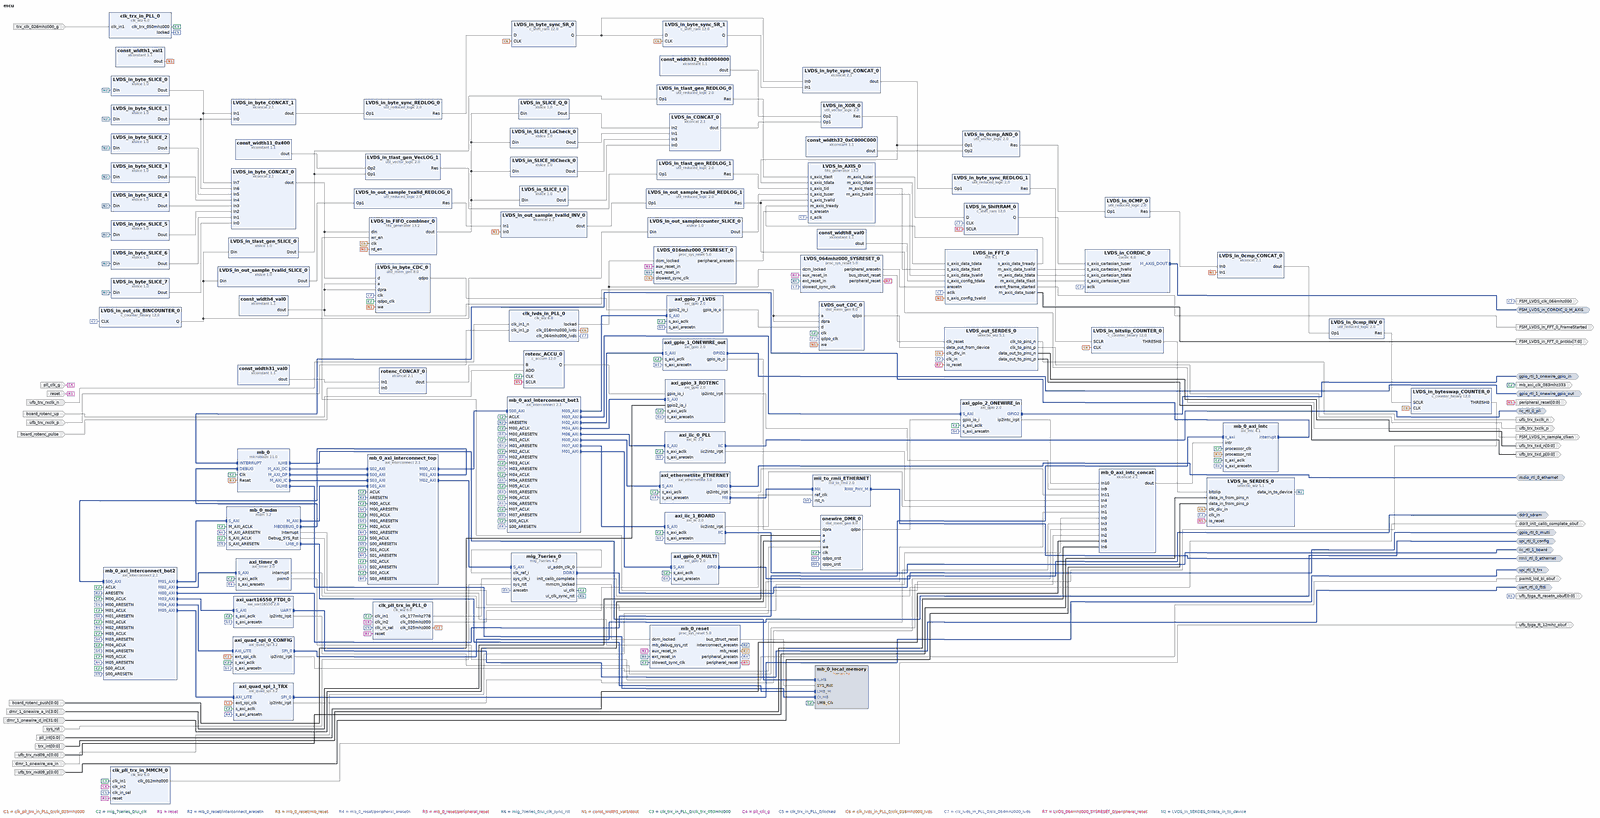
[diagram p0: block diagram of the top level, whole]
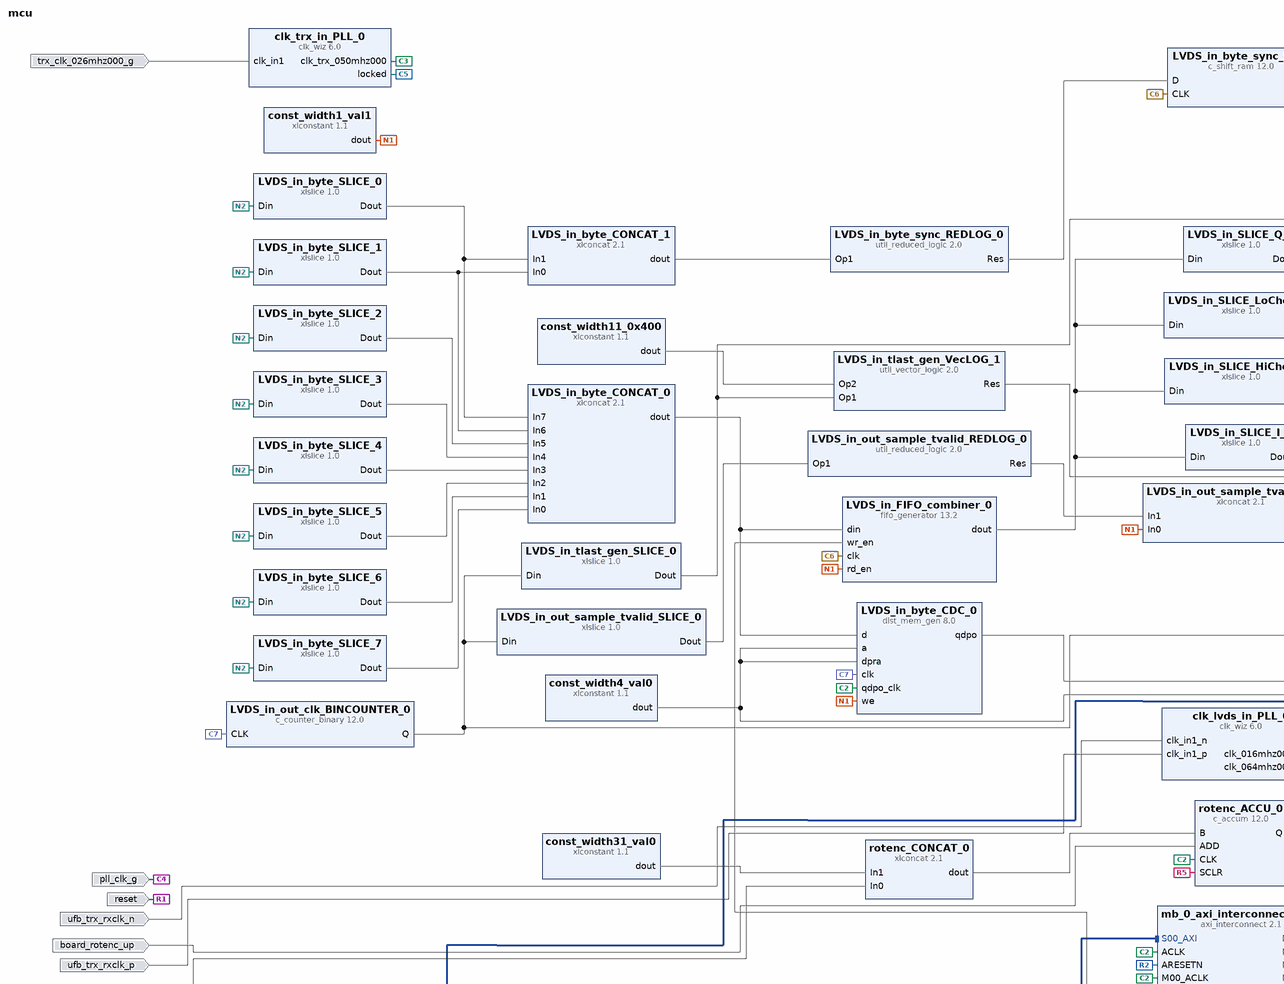
[diagram p1: block diagram of the top level, upper left part]
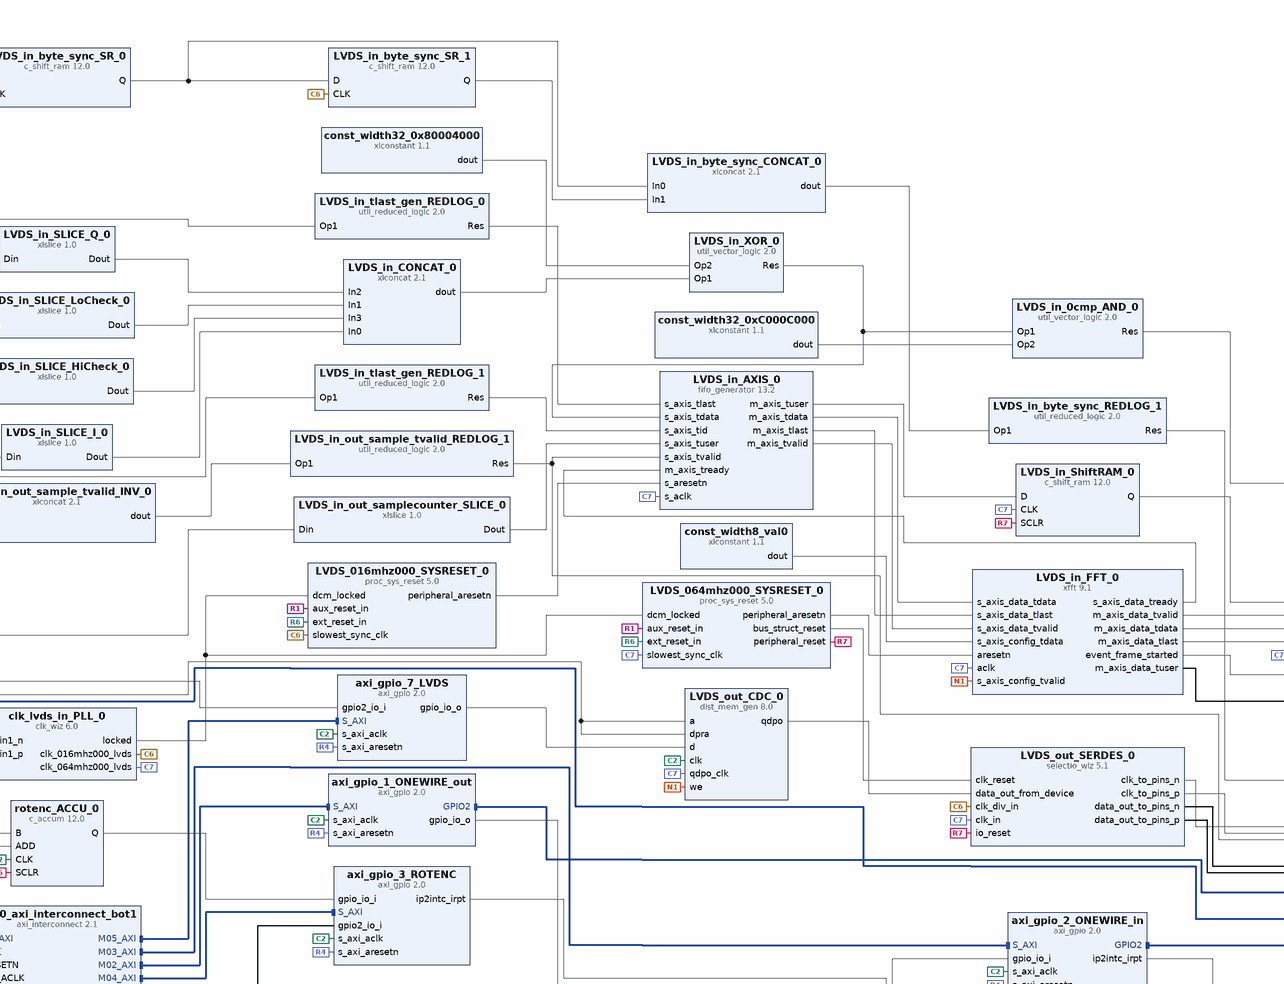
[diagram p2: block diagram of the top level, upper centre part]
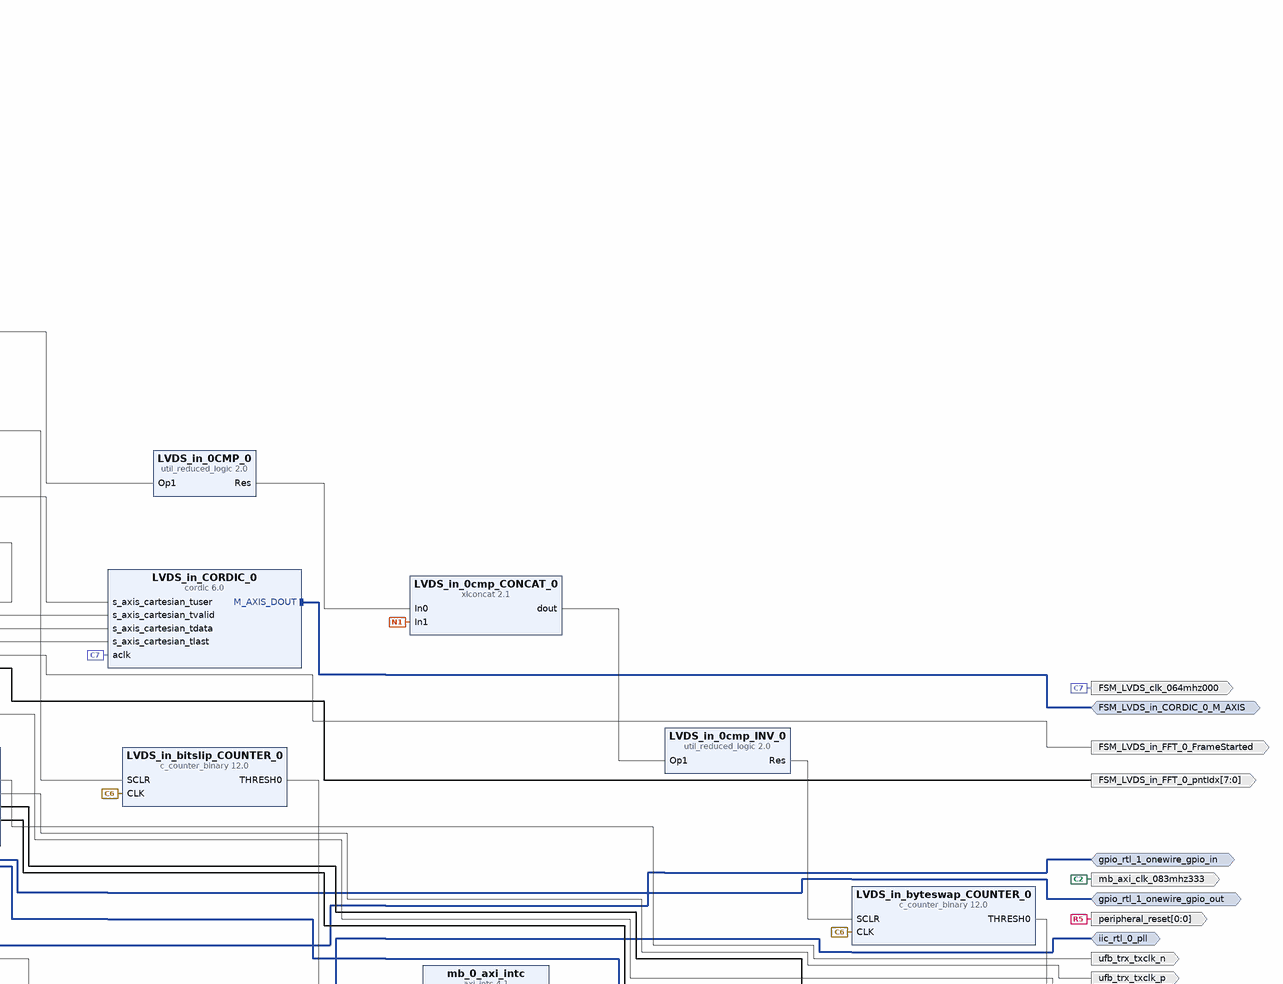
[diagram p3: block diagram of the top level, upper right part]
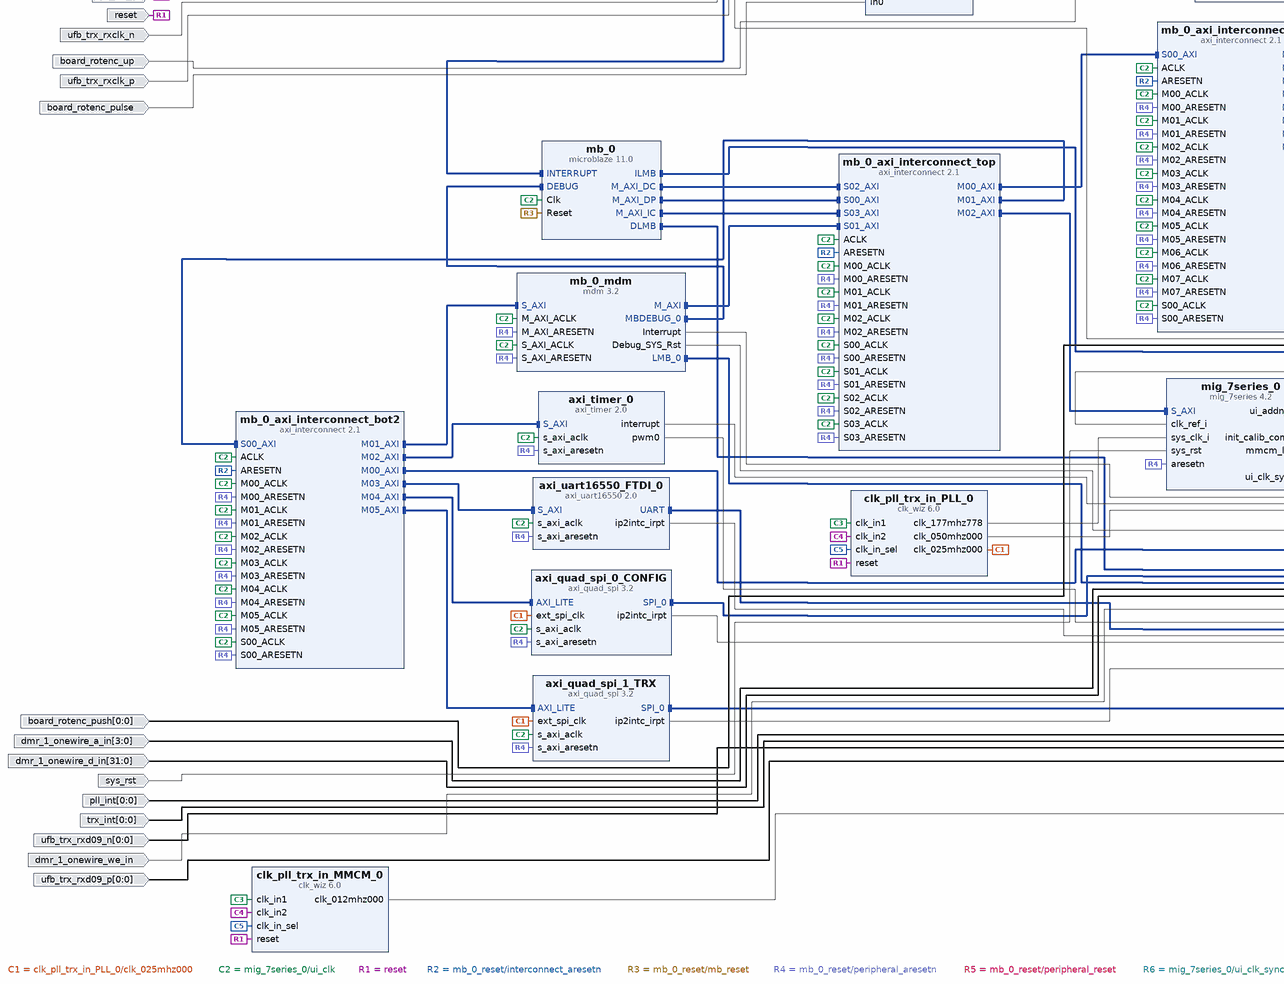
[diagram p4: block diagram of the top level, lower left part]
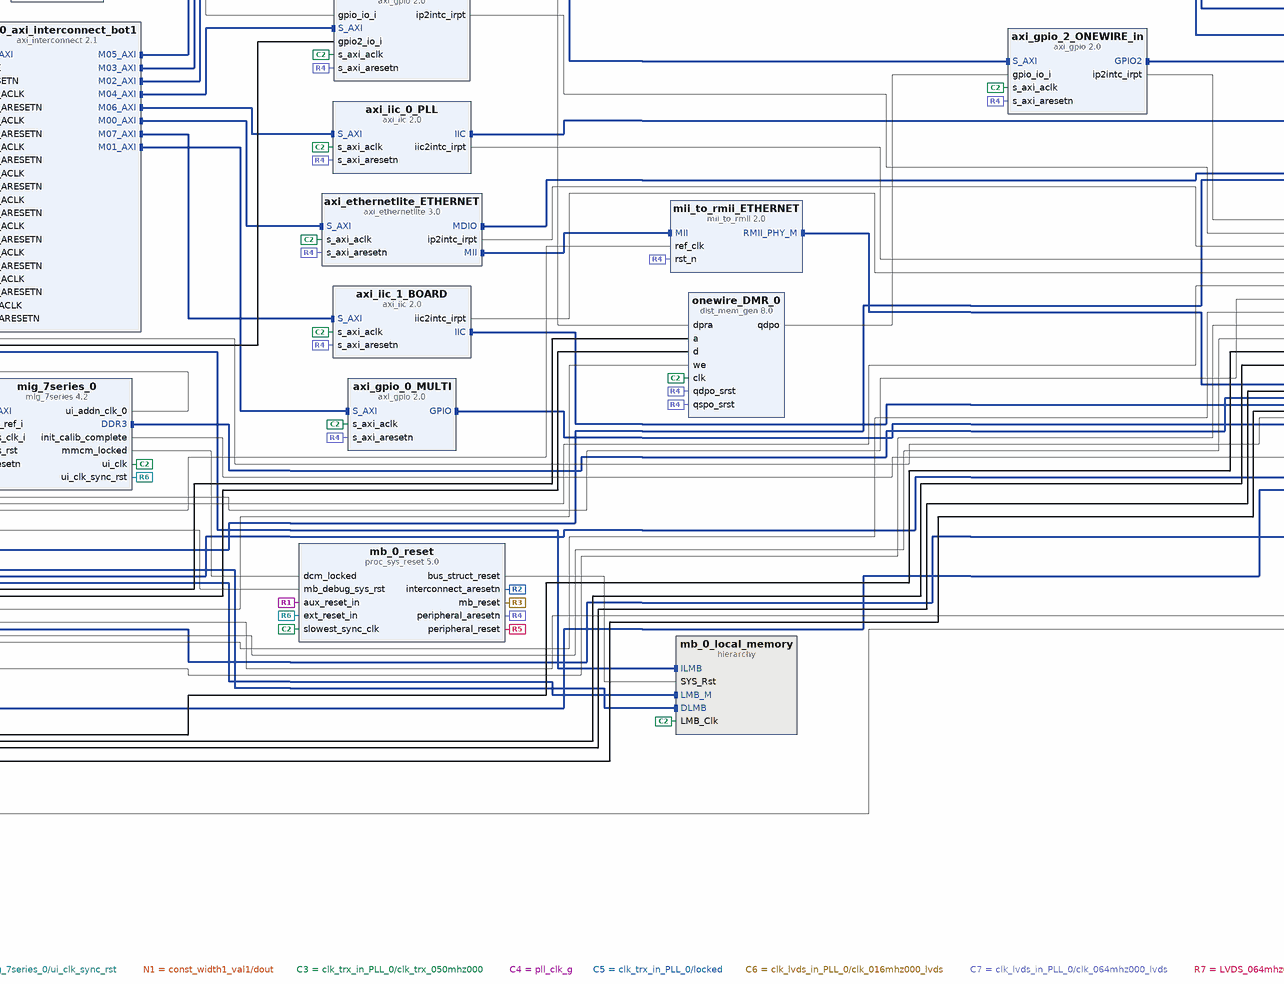
[diagram p5: block diagram of the top level, lower centre part]
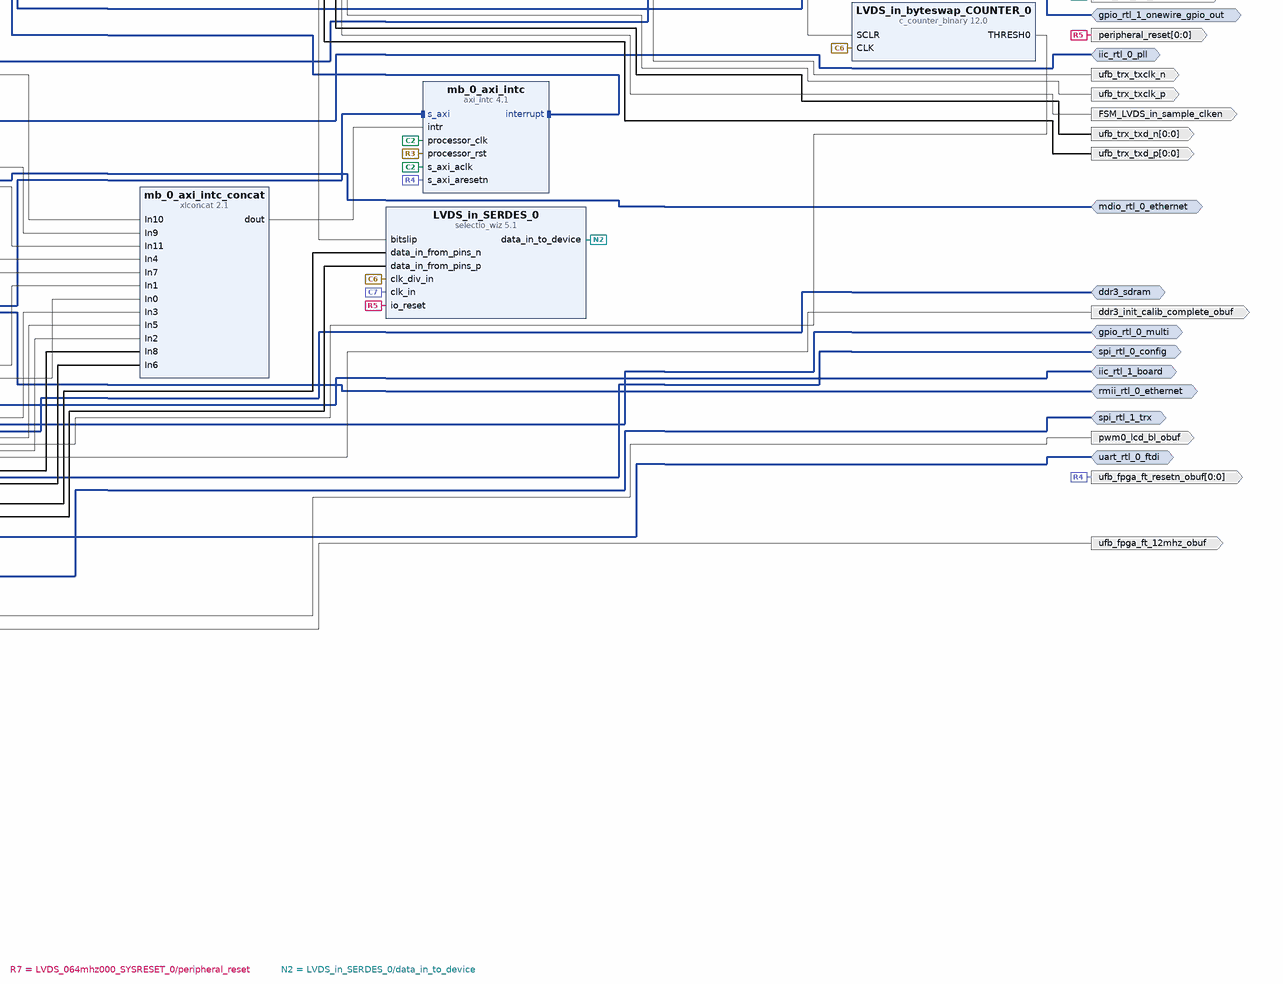
[diagram p6: block diagram of the top level, lower right part]
# Vivado block design mcu, xc7a100tfgg484-2, Vivado 2019.1.2
create_bd_design mcu

create_bd_intf_port -mode Master -vlnv xilinx.com:interface:ddrx_rtl:1.0 ddr3_sdram
create_bd_intf_port -mode Master -vlnv xilinx.com:interface:gpio_rtl:1.0 gpio_rtl_0_multi
create_bd_intf_port -mode Master -vlnv xilinx.com:interface:gpio_rtl:1.0 gpio_rtl_1_onewire_gpio_in
create_bd_intf_port -mode Master -vlnv xilinx.com:interface:gpio_rtl:1.0 gpio_rtl_1_onewire_gpio_out
create_bd_intf_port -mode Master -vlnv xilinx.com:interface:iic_rtl:1.0 iic_rtl_0_pll
create_bd_intf_port -mode Master -vlnv xilinx.com:interface:iic_rtl:1.0 iic_rtl_1_board
create_bd_intf_port -mode Master -vlnv xilinx.com:interface:mdio_rtl:1.0 mdio_rtl_0_ethernet
create_bd_intf_port -mode Master -vlnv xilinx.com:interface:rmii_rtl:1.0 rmii_rtl_0_ethernet
create_bd_intf_port -mode Master -vlnv xilinx.com:interface:spi_rtl:1.0 spi_rtl_0_config
create_bd_intf_port -mode Master -vlnv xilinx.com:interface:spi_rtl:1.0 spi_rtl_1_trx
create_bd_intf_port -mode Master -vlnv xilinx.com:interface:uart_rtl:1.0 uart_rtl_0_ftdi
create_bd_intf_port -mode Master -vlnv xilinx.com:interface:axis_rtl:1.0 FSM_LVDS_in_CORDIC_0_M_AXIS
set_property -dict {CONFIG.FREQ_HZ 64000000 CONFIG.PHASE 0.0} [get_bd_intf_ports FSM_LVDS_in_CORDIC_0_M_AXIS]
create_bd_port -dir I -type ce board_rotenc_pulse
create_bd_port -dir I -from 0 -to 0 board_rotenc_push
create_bd_port -dir I -type data board_rotenc_up
create_bd_port -dir O ddr3_init_calib_complete_obuf
create_bd_port -dir I -from 3 -to 0 dmr_1_onewire_a_in
create_bd_port -dir I -from 31 -to 0 dmr_1_onewire_d_in
create_bd_port -dir I dmr_1_onewire_we_in
create_bd_port -dir O -type clk mb_axi_clk_083mhz333
set_property -dict [list \
  CONFIG.ASSOCIATED_BUSIF gpio_rtl_1_onewire_gpio_in \
  CONFIG.ASSOCIATED_RESET peripheral_reset \
] [get_bd_ports mb_axi_clk_083mhz333]
create_bd_port -dir O -from 0 -to 0 -type rst peripheral_reset
create_bd_port -dir I -from 0 -to 0 pll_int
create_bd_port -dir O pwm0_lcd_bl_obuf
create_bd_port -dir I -type rst reset
set_property -dict {CONFIG.POLARITY ACTIVE_HIGH} [get_bd_ports reset]
create_bd_port -dir I -type rst sys_rst
set_property -dict {CONFIG.POLARITY ACTIVE_HIGH} [get_bd_ports sys_rst]
create_bd_port -dir I -from 0 -to 0 trx_int
create_bd_port -dir O -type clk ufb_fpga_ft_12mhz_obuf
set_property -dict {CONFIG.FREQ_HZ 12000000} [get_bd_ports ufb_fpga_ft_12mhz_obuf]
create_bd_port -dir O -from 0 -to 0 ufb_fpga_ft_resetn_obuf
create_bd_port -dir I -type clk ufb_trx_rxclk_n
set_property -dict {CONFIG.FREQ_HZ 32000000} [get_bd_ports ufb_trx_rxclk_n]
create_bd_port -dir I -type clk ufb_trx_rxclk_p
set_property -dict {CONFIG.FREQ_HZ 32000000} [get_bd_ports ufb_trx_rxclk_p]
create_bd_port -dir I -from 0 -to 0 ufb_trx_rxd09_n
create_bd_port -dir I -from 0 -to 0 ufb_trx_rxd09_p
create_bd_port -dir O -type clk ufb_trx_txclk_n
set_property -dict {CONFIG.FREQ_HZ 32000000} [get_bd_ports ufb_trx_txclk_n]
create_bd_port -dir O -type clk ufb_trx_txclk_p
set_property -dict {CONFIG.FREQ_HZ 32000000} [get_bd_ports ufb_trx_txclk_p]
create_bd_port -dir O -from 0 -to 0 ufb_trx_txd_n
create_bd_port -dir O -from 0 -to 0 ufb_trx_txd_p
create_bd_port -dir I -type clk pll_clk_g
set_property -dict {CONFIG.FREQ_HZ 50000000} [get_bd_ports pll_clk_g]
create_bd_port -dir I -type clk trx_clk_026mhz000_g
set_property -dict {CONFIG.FREQ_HZ 26000000} [get_bd_ports trx_clk_026mhz000_g]
create_bd_port -dir O -type clk FSM_LVDS_clk_064mhz000
create_bd_port -dir O -type intr FSM_LVDS_in_FFT_0_FrameStarted
create_bd_port -dir O -type ce FSM_LVDS_in_sample_clken
create_bd_port -dir O -from 7 -to 0 FSM_LVDS_in_FFT_0_pntIdx

create_bd_cell -type ip -vlnv xilinx.com:ip:dist_mem_gen:8.0 LVDS_in_byte_CDC_0
set_property -dict [list \
  CONFIG.Pipeline_Stages 1 \
  CONFIG.data_width 8 \
  CONFIG.depth 16 \
  CONFIG.dual_port_address non_registered \
  CONFIG.input_clock_enable false \
  CONFIG.input_options registered \
  CONFIG.memory_type simple_dual_port_ram \
  CONFIG.output_options registered \
  CONFIG.simple_dual_port_output_clock_enable false \
] [get_bd_cells LVDS_in_byte_CDC_0]
create_bd_cell -type ip -vlnv xilinx.com:ip:dist_mem_gen:8.0 LVDS_out_CDC_0
set_property -dict [list \
  CONFIG.Pipeline_Stages 1 \
  CONFIG.data_width 8 \
  CONFIG.depth 16 \
  CONFIG.dual_port_address non_registered \
  CONFIG.input_clock_enable false \
  CONFIG.input_options registered \
  CONFIG.memory_type simple_dual_port_ram \
  CONFIG.output_options registered \
  CONFIG.simple_dual_port_output_clock_enable false \
] [get_bd_cells LVDS_out_CDC_0]
create_bd_cell -type ip -vlnv xilinx.com:ip:axi_ethernetlite:3.0 axi_ethernetlite_ETHERNET
set_property -dict [list \
  CONFIG.C_DUPLEX 1 \
  CONFIG.C_INCLUDE_GLOBAL_BUFFERS 1 \
  CONFIG.C_INCLUDE_INTERNAL_LOOPBACK 1 \
  CONFIG.C_S_AXI_PROTOCOL AXI4LITE \
] [get_bd_cells axi_ethernetlite_ETHERNET]
create_bd_cell -type ip -vlnv xilinx.com:ip:axi_gpio:2.0 axi_gpio_0_MULTI
set_property -dict {CONFIG.C_ALL_OUTPUTS 1 CONFIG.C_GPIO_WIDTH 8} [get_bd_cells axi_gpio_0_MULTI]
create_bd_cell -type ip -vlnv xilinx.com:ip:axi_gpio:2.0 axi_gpio_1_ONEWIRE_out
set_property -dict [list \
  CONFIG.C_ALL_OUTPUTS 1 \
  CONFIG.C_ALL_OUTPUTS_2 1 \
  CONFIG.C_GPIO_WIDTH 4 \
  CONFIG.C_IS_DUAL 1 \
] [get_bd_cells axi_gpio_1_ONEWIRE_out]
create_bd_cell -type ip -vlnv xilinx.com:ip:axi_gpio:2.0 axi_gpio_2_ONEWIRE_in
set_property -dict [list \
  CONFIG.C_ALL_INPUTS 1 \
  CONFIG.C_ALL_INPUTS_2 1 \
  CONFIG.C_GPIO2_WIDTH 32 \
  CONFIG.C_GPIO_WIDTH 32 \
  CONFIG.C_INTERRUPT_PRESENT 1 \
  CONFIG.C_IS_DUAL 1 \
] [get_bd_cells axi_gpio_2_ONEWIRE_in]
create_bd_cell -type ip -vlnv xilinx.com:ip:axi_gpio:2.0 axi_gpio_3_ROTENC
set_property -dict [list \
  CONFIG.C_ALL_INPUTS 1 \
  CONFIG.C_ALL_INPUTS_2 1 \
  CONFIG.C_GPIO2_WIDTH 1 \
  CONFIG.C_INTERRUPT_PRESENT 1 \
  CONFIG.C_IS_DUAL 1 \
] [get_bd_cells axi_gpio_3_ROTENC]
create_bd_cell -type ip -vlnv xilinx.com:ip:axi_gpio:2.0 axi_gpio_7_LVDS
set_property -dict [list \
  CONFIG.C_ALL_INPUTS_2 1 \
  CONFIG.C_ALL_OUTPUTS 1 \
  CONFIG.C_GPIO2_WIDTH 8 \
  CONFIG.C_GPIO_WIDTH 8 \
  CONFIG.C_IS_DUAL 1 \
] [get_bd_cells axi_gpio_7_LVDS]
create_bd_cell -type ip -vlnv xilinx.com:ip:axi_iic:2.0 axi_iic_0_PLL
set_property -dict {CONFIG.C_SDA_LEVEL 1 CONFIG.IIC_FREQ_KHZ 400} [get_bd_cells axi_iic_0_PLL]
create_bd_cell -type ip -vlnv xilinx.com:ip:axi_iic:2.0 axi_iic_1_BOARD
set_property -dict {CONFIG.IIC_FREQ_KHZ 400} [get_bd_cells axi_iic_1_BOARD]
create_bd_cell -type ip -vlnv xilinx.com:ip:axi_quad_spi:3.2 axi_quad_spi_0_CONFIG
set_property -dict [list \
  CONFIG.C_FIFO_DEPTH 256 \
  CONFIG.C_SHARED_STARTUP 0 \
  CONFIG.C_SPI_MEMORY 3 \
  CONFIG.C_SPI_MODE 2 \
  CONFIG.C_TYPE_OF_AXI4_INTERFACE 0 \
  CONFIG.C_USE_STARTUP 1 \
] [get_bd_cells axi_quad_spi_0_CONFIG]
create_bd_cell -type ip -vlnv xilinx.com:ip:axi_quad_spi:3.2 axi_quad_spi_1_TRX
set_property -dict {CONFIG.C_SCK_RATIO 8 CONFIG.C_SPI_MODE 0 CONFIG.C_USE_STARTUP 0} [get_bd_cells axi_quad_spi_1_TRX]
create_bd_cell -type ip -vlnv xilinx.com:ip:axi_timer:2.0 axi_timer_0
create_bd_cell -type ip -vlnv xilinx.com:ip:axi_uart16550:2.0 axi_uart16550_FTDI_0
create_bd_cell -type ip -vlnv xilinx.com:ip:c_accum:12.0 rotenc_ACCU_0
set_property -dict [list \
  CONFIG.Accum_Mode Add_Subtract \
  CONFIG.Bypass false \
  CONFIG.CE false \
  CONFIG.C_In false \
  CONFIG.Implementation DSP48 \
  CONFIG.Input_Type Signed \
  CONFIG.Input_Width 32 \
  CONFIG.Latency_Configuration Automatic \
  CONFIG.Output_Width 32 \
  CONFIG.SCLR true \
] [get_bd_cells rotenc_ACCU_0]
create_bd_cell -type ip -vlnv xilinx.com:ip:clk_wiz:6.0 clk_lvds_in_PLL_0
set_property -dict [list \
  CONFIG.AXI_DRP false \
  CONFIG.CLKIN1_JITTER_PS 156.25 \
  CONFIG.CLKOUT1_DRIVES BUFG \
  CONFIG.CLKOUT1_JITTER 149.670 \
  CONFIG.CLKOUT1_MATCHED_ROUTING true \
  CONFIG.CLKOUT1_PHASE_ERROR 114.696 \
  CONFIG.CLKOUT1_REQUESTED_OUT_FREQ 128 \
  CONFIG.CLKOUT1_USED true \
  CONFIG.CLKOUT2_DRIVES BUFG \
  CONFIG.CLKOUT2_JITTER 174.718 \
  CONFIG.CLKOUT2_MATCHED_ROUTING false \
  CONFIG.CLKOUT2_PHASE_ERROR 114.696 \
  CONFIG.CLKOUT2_REQUESTED_OUT_FREQ 64 \
  CONFIG.CLKOUT2_USED true \
  CONFIG.CLKOUT3_DRIVES BUFG \
  CONFIG.CLKOUT3_JITTER 237.501 \
  CONFIG.CLKOUT3_PHASE_ERROR 114.696 \
  CONFIG.CLKOUT3_REQUESTED_OUT_FREQ 16 \
  CONFIG.CLKOUT3_USED true \
  CONFIG.CLKOUT4_DRIVES BUFG \
  CONFIG.CLKOUT4_JITTER 158.007 \
  CONFIG.CLKOUT4_PHASE_ERROR 114.696 \
  CONFIG.CLKOUT4_REQUESTED_OUT_FREQ 100.000 \
  CONFIG.CLKOUT4_USED false \
  CONFIG.CLKOUT5_DRIVES BUFG \
  CONFIG.CLKOUT6_DRIVES BUFG \
  CONFIG.CLKOUT7_DRIVES BUFG \
  CONFIG.CLK_OUT1_PORT clk_128mhz000_lvds \
  CONFIG.CLK_OUT1_USE_FINE_PS_GUI false \
  CONFIG.CLK_OUT2_PORT clk_064mhz000_lvds \
  CONFIG.CLK_OUT2_USE_FINE_PS_GUI false \
  CONFIG.CLK_OUT3_PORT clk_016mhz000_lvds \
  CONFIG.CLK_OUT4_PORT clk_out4 \
  CONFIG.FEEDBACK_SOURCE FDBK_AUTO \
  CONFIG.INTERFACE_SELECTION Enable_AXI \
  CONFIG.MMCM_BANDWIDTH OPTIMIZED \
  CONFIG.MMCM_CLKFBOUT_MULT_F 14 \
  CONFIG.MMCM_CLKIN1_PERIOD 15.625 \
  CONFIG.MMCM_CLKIN2_PERIOD 10.000 \
  CONFIG.MMCM_CLKOUT0_DIVIDE_F 7 \
  CONFIG.MMCM_CLKOUT0_USE_FINE_PS false \
  CONFIG.MMCM_CLKOUT1_DIVIDE 14 \
  CONFIG.MMCM_CLKOUT1_USE_FINE_PS false \
  CONFIG.MMCM_CLKOUT2_DIVIDE 56 \
  CONFIG.MMCM_CLKOUT3_DIVIDE 1 \
  CONFIG.MMCM_COMPENSATION ZHOLD \
  CONFIG.MMCM_DIVCLK_DIVIDE 1 \
  CONFIG.NUM_OUT_CLKS 3 \
  CONFIG.PHASE_DUTY_CONFIG false \
  CONFIG.PRIMITIVE PLL \
  CONFIG.PRIM_IN_FREQ 64 \
  CONFIG.PRIM_SOURCE Differential_clock_capable_pin \
  CONFIG.USE_DYN_PHASE_SHIFT false \
  CONFIG.USE_DYN_RECONFIG false \
  CONFIG.USE_LOCKED true \
  CONFIG.USE_RESET false \
  CONFIG.USE_SAFE_CLOCK_STARTUP false \
] [get_bd_cells clk_lvds_in_PLL_0]
create_bd_cell -type ip -vlnv xilinx.com:ip:dist_mem_gen:8.0 onewire_DMR_0
set_property -dict [list \
  CONFIG.Pipeline_Stages 0 \
  CONFIG.common_output_clk true \
  CONFIG.data_width 32 \
  CONFIG.depth 16 \
  CONFIG.dual_port_address registered \
  CONFIG.input_clock_enable false \
  CONFIG.input_options registered \
  CONFIG.memory_type dual_port_ram \
  CONFIG.output_options registered \
  CONFIG.simple_dual_port_output_clock_enable false \
  CONFIG.sync_reset_qdpo true \
  CONFIG.sync_reset_qspo true \
] [get_bd_cells onewire_DMR_0]
create_bd_cell -type ip -vlnv xilinx.com:ip:microblaze:11.0 mb_0
set_property -dict [list \
  CONFIG.C_ADDR_TAG_BITS 17 \
  CONFIG.C_AREA_OPTIMIZED 0 \
  CONFIG.C_CACHE_BYTE_SIZE 8192 \
  CONFIG.C_DATA_SIZE 32 \
  CONFIG.C_DCACHE_ADDR_TAG 17 \
  CONFIG.C_DCACHE_BYTE_SIZE 8192 \
  CONFIG.C_DCACHE_LINE_LEN 4 \
  CONFIG.C_DCACHE_USE_WRITEBACK 0 \
  CONFIG.C_DEBUG_ENABLED 2 \
  CONFIG.C_DIV_ZERO_EXCEPTION 0 \
  CONFIG.C_D_AXI 1 \
  CONFIG.C_D_LMB 1 \
  CONFIG.C_ICACHE_LINE_LEN 8 \
  CONFIG.C_ICACHE_STREAMS 0 \
  CONFIG.C_ICACHE_VICTIMS 0 \
  CONFIG.C_ILL_OPCODE_EXCEPTION 0 \
  CONFIG.C_I_LMB 1 \
  CONFIG.C_M_AXI_D_BUS_EXCEPTION 1 \
  CONFIG.C_M_AXI_I_BUS_EXCEPTION 0 \
  CONFIG.C_NUMBER_OF_PC_BRK 5 \
  CONFIG.C_PVR 0 \
  CONFIG.C_UNALIGNED_EXCEPTIONS 0 \
  CONFIG.C_USE_BARREL 1 \
  CONFIG.C_USE_BRANCH_TARGET_CACHE 0 \
  CONFIG.C_USE_DCACHE 1 \
  CONFIG.C_USE_DIV 1 \
  CONFIG.C_USE_FPU 0 \
  CONFIG.C_USE_HW_MUL 1 \
  CONFIG.C_USE_ICACHE 1 \
  CONFIG.C_USE_MMU 0 \
  CONFIG.C_USE_MSR_INSTR 1 \
  CONFIG.C_USE_PCMP_INSTR 1 \
  CONFIG.C_USE_REORDER_INSTR 1 \
  CONFIG.G_TEMPLATE_LIST 6 \
  CONFIG.G_USE_EXCEPTIONS 1 \
] [get_bd_cells mb_0]
create_bd_cell -type ip -vlnv xilinx.com:ip:axi_intc:4.1 mb_0_axi_intc
set_property -dict {CONFIG.C_HAS_FAST 1 CONFIG.C_IRQ_IS_LEVEL 0} [get_bd_cells mb_0_axi_intc]
create_bd_cell -type ip -vlnv xilinx.com:ip:xlconcat:2.1 mb_0_axi_intc_concat
set_property -dict {CONFIG.NUM_PORTS 12} [get_bd_cells mb_0_axi_intc_concat]
create_bd_cell -type ip -vlnv xilinx.com:ip:axi_interconnect:2.1 mb_0_axi_interconnect_top
set_property -dict [list \
  CONFIG.ENABLE_ADVANCED_OPTIONS 0 \
  CONFIG.NUM_MI 3 \
  CONFIG.NUM_SI 4 \
  CONFIG.STRATEGY 0 \
] [get_bd_cells mb_0_axi_interconnect_top]
create_bd_cell -type hier mb_0_local_memory
create_bd_cell -type ip -vlnv xilinx.com:ip:mdm:3.2 mb_0_mdm
set_property -dict [list \
  CONFIG.C_ADDR_SIZE 32 \
  CONFIG.C_DBG_MEM_ACCESS 1 \
  CONFIG.C_DBG_REG_ACCESS 0 \
  CONFIG.C_M_AXI_ADDR_WIDTH 32 \
  CONFIG.C_S_AXI_ADDR_WIDTH 4 \
  CONFIG.C_TRACE_OUTPUT 0 \
  CONFIG.C_USE_CROSS_TRIGGER 1 \
  CONFIG.C_USE_UART 1 \
] [get_bd_cells mb_0_mdm]
create_bd_cell -type ip -vlnv xilinx.com:ip:proc_sys_reset:5.0 mb_0_reset
set_property -dict {CONFIG.C_AUX_RESET_HIGH 1} [get_bd_cells mb_0_reset]
create_bd_cell -type ip -vlnv xilinx.com:ip:mig_7series:4.2 mig_7series_0
set_property -dict [list \
  CONFIG.BOARD_MIG_PARAM Custom \
  CONFIG.MIG_DONT_TOUCH_PARAM Custom \
  CONFIG.RESET_BOARD_INTERFACE Custom \
  CONFIG.XML_INPUT_FILE mig_b.prj \
] [get_bd_cells mig_7series_0]
create_bd_cell -type ip -vlnv xilinx.com:ip:mii_to_rmii:2.0 mii_to_rmii_ETHERNET
set_property -dict {CONFIG.C_FIXED_SPEED 0 CONFIG.C_INCLUDE_BUF 1} [get_bd_cells mii_to_rmii_ETHERNET]
create_bd_cell -type ip -vlnv xilinx.com:ip:selectio_wiz:5.1 LVDS_in_SERDES_0
set_property -dict [list \
  CONFIG.BUS_IO_STD LVDS_25 \
  CONFIG.BUS_SIG_TYPE DIFF \
  CONFIG.CLK_EN false \
  CONFIG.CLK_FWD_IO_STD DIFF_HSTL_I \
  CONFIG.CLK_FWD_SIG_TYPE DIFF \
  CONFIG.INCLUDE_IDELAYCTRL false \
  CONFIG.INCLUDE_IDELAYCTRL_BUFG false \
  CONFIG.SELIO_ACTIVE_EDGE DDR \
  CONFIG.SELIO_BUS_IN_DELAY NONE \
  CONFIG.SELIO_CLK_BUF MMCM \
  CONFIG.SELIO_CLK_IO_STD LVDS_25 \
  CONFIG.SELIO_CLK_SIG_TYPE DIFF \
  CONFIG.SELIO_INTERFACE_TYPE NETWORKING \
  CONFIG.SERIALIZATION_FACTOR 8 \
  CONFIG.SYSTEM_DATA_WIDTH 1 \
  CONFIG.USE_SERIALIZATION true \
] [get_bd_cells LVDS_in_SERDES_0]
create_bd_cell -type ip -vlnv xilinx.com:ip:selectio_wiz:5.1 LVDS_out_SERDES_0
set_property -dict [list \
  CONFIG.BUS_DIR OUTPUTS \
  CONFIG.BUS_IO_STD LVDS_25 \
  CONFIG.BUS_SIG_TYPE DIFF \
  CONFIG.CLK_FWD true \
  CONFIG.CLK_FWD_IO_STD DIFF_HSTL_I \
  CONFIG.CLK_FWD_SIG_TYPE DIFF \
  CONFIG.SELIO_ACTIVE_EDGE DDR \
  CONFIG.SELIO_BUS_IN_DELAY NONE \
  CONFIG.SELIO_CLK_BUF MMCM \
  CONFIG.SELIO_CLK_IO_STD LVDS_25 \
  CONFIG.SELIO_CLK_SIG_TYPE DIFF \
  CONFIG.SELIO_INTERFACE_TYPE NETWORKING \
  CONFIG.SERIALIZATION_FACTOR 8 \
  CONFIG.SYSTEM_DATA_WIDTH 1 \
  CONFIG.USE_SERIALIZATION true \
  CONFIG.USE_TEMPLATE Custom \
] [get_bd_cells LVDS_out_SERDES_0]
create_bd_cell -type ip -vlnv xilinx.com:ip:xlconcat:2.1 rotenc_CONCAT_0
create_bd_cell -type ip -vlnv xilinx.com:ip:xlconstant:1.1 const_width4_val0
set_property -dict {CONFIG.CONST_VAL 0 CONFIG.CONST_WIDTH 4} [get_bd_cells const_width4_val0]
create_bd_cell -type ip -vlnv xilinx.com:ip:xlconstant:1.1 const_width1_val1
create_bd_cell -type ip -vlnv xilinx.com:ip:xlconstant:1.1 const_width31_val0
set_property -dict {CONFIG.CONST_VAL 0 CONFIG.CONST_WIDTH 31} [get_bd_cells const_width31_val0]
create_bd_cell -type ip -vlnv xilinx.com:ip:axi_interconnect:2.1 mb_0_axi_interconnect_bot1
set_property -dict [list \
  CONFIG.ENABLE_ADVANCED_OPTIONS 0 \
  CONFIG.NUM_MI 8 \
  CONFIG.NUM_SI 1 \
  CONFIG.STRATEGY 0 \
] [get_bd_cells mb_0_axi_interconnect_bot1]
create_bd_cell -type ip -vlnv xilinx.com:ip:axi_interconnect:2.1 mb_0_axi_interconnect_bot2
set_property -dict [list \
  CONFIG.ENABLE_ADVANCED_OPTIONS 0 \
  CONFIG.NUM_MI 6 \
  CONFIG.NUM_SI 1 \
  CONFIG.STRATEGY 0 \
] [get_bd_cells mb_0_axi_interconnect_bot2]
create_bd_cell -type ip -vlnv xilinx.com:ip:fifo_generator:13.2 LVDS_in_FIFO_combiner_0
set_property -dict [list \
  CONFIG.FIFO_Implementation_rach Common_Clock_Distributed_RAM \
  CONFIG.FIFO_Implementation_wach Common_Clock_Distributed_RAM \
  CONFIG.FIFO_Implementation_wrch Common_Clock_Distributed_RAM \
  CONFIG.Fifo_Implementation Common_Clock_Block_RAM \
  CONFIG.INTERFACE_TYPE Native \
  CONFIG.Input_Data_Width 8 \
  CONFIG.Input_Depth 64 \
  CONFIG.Output_Data_Width 32 \
  CONFIG.Performance_Options Standard_FIFO \
  CONFIG.Reset_Pin false \
  CONFIG.Use_Embedded_Registers true \
  CONFIG.Valid_Flag false \
  CONFIG.Write_Acknowledge_Flag false \
] [get_bd_cells LVDS_in_FIFO_combiner_0]
create_bd_cell -type ip -vlnv xilinx.com:ip:fifo_generator:13.2 LVDS_in_AXIS_0
set_property -dict [list \
  CONFIG.Clock_Type_AXI Common_Clock \
  CONFIG.Enable_Safety_Circuit true \
  CONFIG.Enable_TLAST true \
  CONFIG.FIFO_Implementation_axis Common_Clock_Block_RAM \
  CONFIG.FIFO_Implementation_rach Common_Clock_Distributed_RAM \
  CONFIG.FIFO_Implementation_rdch Common_Clock_Block_RAM \
  CONFIG.FIFO_Implementation_wach Common_Clock_Distributed_RAM \
  CONFIG.FIFO_Implementation_wdch Common_Clock_Block_RAM \
  CONFIG.FIFO_Implementation_wrch Common_Clock_Distributed_RAM \
  CONFIG.Fifo_Implementation Independent_Clocks_Block_RAM \
  CONFIG.Full_Flags_Reset_Value 1 \
  CONFIG.HAS_ACLKEN false \
  CONFIG.INTERFACE_TYPE AXI_STREAM \
  CONFIG.Input_Data_Width 8 \
  CONFIG.Input_Depth 64 \
  CONFIG.Output_Data_Width 32 \
  CONFIG.Register_Slice_Mode_axis Light_Weight \
  CONFIG.TDATA_NUM_BYTES 4 \
  CONFIG.TID_WIDTH 1 \
  CONFIG.TUSER_WIDTH 44 \
  CONFIG.Use_Dout_Reset true \
  CONFIG.Use_Embedded_Registers true \
  CONFIG.Use_Embedded_Registers_axis false \
  CONFIG.Valid_Flag false \
  CONFIG.Write_Acknowledge_Flag false \
  CONFIG.axis_type FIFO \
] [get_bd_cells LVDS_in_AXIS_0]
create_bd_cell -type ip -vlnv xilinx.com:ip:xlconcat:2.1 LVDS_in_CONCAT_0
set_property -dict [list \
  CONFIG.IN0_WIDTH 14 \
  CONFIG.IN1_WIDTH 2 \
  CONFIG.IN2_WIDTH 14 \
  CONFIG.IN3_WIDTH 2 \
  CONFIG.NUM_PORTS 4 \
] [get_bd_cells LVDS_in_CONCAT_0]
create_bd_cell -type ip -vlnv xilinx.com:ip:xlslice:1.0 LVDS_in_SLICE_Q_0
set_property -dict {CONFIG.DIN_FROM 13 CONFIG.DIN_TO 0 CONFIG.DOUT_WIDTH 14} [get_bd_cells LVDS_in_SLICE_Q_0]
create_bd_cell -type ip -vlnv xilinx.com:ip:xlslice:1.0 LVDS_in_SLICE_I_0
set_property -dict {CONFIG.DIN_FROM 29 CONFIG.DIN_TO 16 CONFIG.DOUT_WIDTH 14} [get_bd_cells LVDS_in_SLICE_I_0]
create_bd_cell -type ip -vlnv xilinx.com:ip:xlslice:1.0 LVDS_in_SLICE_LoCheck_0
set_property -dict {CONFIG.DIN_FROM 1 CONFIG.DIN_TO 0 CONFIG.DOUT_WIDTH 2} [get_bd_cells LVDS_in_SLICE_LoCheck_0]
create_bd_cell -type ip -vlnv xilinx.com:ip:xlslice:1.0 LVDS_in_SLICE_HiCheck_0
set_property -dict {CONFIG.DIN_FROM 31 CONFIG.DIN_TO 30 CONFIG.DOUT_WIDTH 2} [get_bd_cells LVDS_in_SLICE_HiCheck_0]
create_bd_cell -type ip -vlnv xilinx.com:ip:util_vector_logic:2.0 LVDS_in_XOR_0
set_property -dict {CONFIG.C_OPERATION xor CONFIG.C_SIZE 32} [get_bd_cells LVDS_in_XOR_0]
create_bd_cell -type ip -vlnv xilinx.com:ip:util_vector_logic:2.0 LVDS_in_0cmp_AND_0
set_property -dict {CONFIG.C_OPERATION and CONFIG.C_SIZE 32} [get_bd_cells LVDS_in_0cmp_AND_0]
create_bd_cell -type ip -vlnv xilinx.com:ip:util_reduced_logic:2.0 LVDS_in_0CMP_0
set_property -dict {CONFIG.C_OPERATION or CONFIG.C_SIZE 32} [get_bd_cells LVDS_in_0CMP_0]
create_bd_cell -type ip -vlnv xilinx.com:ip:xlconstant:1.1 const_width32_0x80004000
set_property -dict {CONFIG.CONST_VAL 2147500032 CONFIG.CONST_WIDTH 32} [get_bd_cells const_width32_0x80004000]
create_bd_cell -type ip -vlnv xilinx.com:ip:xlconstant:1.1 const_width32_0xC000C000
set_property -dict {CONFIG.CONST_VAL 3221274624 CONFIG.CONST_WIDTH 32} [get_bd_cells const_width32_0xC000C000]
create_bd_cell -type ip -vlnv xilinx.com:ip:xfft:9.1 LVDS_in_FFT_0
set_property -dict [list \
  CONFIG.aclken false \
  CONFIG.aresetn true \
  CONFIG.butterfly_type use_xtremedsp_slices \
  CONFIG.complex_mult_type use_mults_performance \
  CONFIG.implementation_options pipelined_streaming_io \
  CONFIG.input_width 16 \
  CONFIG.memory_options_data distributed_ram \
  CONFIG.memory_options_phase_factors distributed_ram \
  CONFIG.number_of_stages_using_block_ram_for_data_and_phase_factors 0 \
  CONFIG.output_ordering bit_reversed_order \
  CONFIG.phase_factor_width 16 \
  CONFIG.rounding_modes convergent_rounding \
  CONFIG.scaling_options unscaled \
  CONFIG.target_clock_frequency 64 \
  CONFIG.target_data_throughput 4 \
  CONFIG.throttle_scheme realtime \
  CONFIG.transform_length 128 \
  CONFIG.xk_index true \
] [get_bd_cells LVDS_in_FFT_0]
create_bd_cell -type ip -vlnv xilinx.com:ip:clk_wiz:6.0 clk_trx_in_PLL_0
set_property -dict [list \
  CONFIG.CLKIN1_JITTER_PS 384.61 \
  CONFIG.CLKIN2_JITTER_PS 106.24 \
  CONFIG.CLKOUT1_DRIVES BUFG \
  CONFIG.CLKOUT1_JITTER 187.765 \
  CONFIG.CLKOUT1_PHASE_ERROR 208.908 \
  CONFIG.CLKOUT1_REQUESTED_OUT_FREQ 50.0 \
  CONFIG.CLKOUT2_DRIVES BUFG \
  CONFIG.CLKOUT2_JITTER 137.681 \
  CONFIG.CLKOUT2_PHASE_ERROR 105.461 \
  CONFIG.CLKOUT2_USED false \
  CONFIG.CLKOUT3_DRIVES BUFG \
  CONFIG.CLKOUT3_JITTER 137.681 \
  CONFIG.CLKOUT3_PHASE_ERROR 105.461 \
  CONFIG.CLKOUT3_USED false \
  CONFIG.CLKOUT4_DRIVES BUFG \
  CONFIG.CLKOUT4_JITTER 137.681 \
  CONFIG.CLKOUT4_PHASE_ERROR 105.461 \
  CONFIG.CLKOUT4_USED false \
  CONFIG.CLKOUT5_DRIVES BUFG \
  CONFIG.CLKOUT5_JITTER 137.681 \
  CONFIG.CLKOUT5_PHASE_ERROR 105.461 \
  CONFIG.CLKOUT5_USED false \
  CONFIG.CLKOUT6_DRIVES BUFG \
  CONFIG.CLKOUT7_DRIVES BUFG \
  CONFIG.CLK_OUT1_PORT clk_trx_050mhz000 \
  CONFIG.FEEDBACK_SOURCE FDBK_AUTO \
  CONFIG.MMCM_BANDWIDTH OPTIMIZED \
  CONFIG.MMCM_CLKFBOUT_MULT_F 50 \
  CONFIG.MMCM_CLKIN1_PERIOD 38.462 \
  CONFIG.MMCM_CLKIN2_PERIOD 10.0 \
  CONFIG.MMCM_CLKOUT0_DIVIDE_F 26 \
  CONFIG.MMCM_CLKOUT1_DIVIDE 1 \
  CONFIG.MMCM_CLKOUT2_DIVIDE 1 \
  CONFIG.MMCM_CLKOUT3_DIVIDE 1 \
  CONFIG.MMCM_CLKOUT4_DIVIDE 1 \
  CONFIG.MMCM_COMPENSATION ZHOLD \
  CONFIG.MMCM_DIVCLK_DIVIDE 1 \
  CONFIG.NUM_OUT_CLKS 1 \
  CONFIG.PRIMITIVE PLL \
  CONFIG.PRIM_IN_FREQ 26.000 \
  CONFIG.SECONDARY_SOURCE Single_ended_clock_capable_pin \
  CONFIG.USE_INCLK_SWITCHOVER false \
  CONFIG.USE_RESET false \
] [get_bd_cells clk_trx_in_PLL_0]
create_bd_cell -type ip -vlnv xilinx.com:ip:clk_wiz:6.0 clk_pll_trx_in_PLL_0
set_property -dict [list \
  CONFIG.AXI_DRP false \
  CONFIG.CLKIN1_JITTER_PS 200.0 \
  CONFIG.CLKIN2_JITTER_PS 200.0 \
  CONFIG.CLKOUT1_DRIVES BUFG \
  CONFIG.CLKOUT1_JITTER 96.666 \
  CONFIG.CLKOUT1_PHASE_ERROR 120.359 \
  CONFIG.CLKOUT1_REQUESTED_OUT_FREQ 200 \
  CONFIG.CLKOUT2_DRIVES BUFG \
  CONFIG.CLKOUT2_JITTER 98.321 \
  CONFIG.CLKOUT2_MATCHED_ROUTING true \
  CONFIG.CLKOUT2_PHASE_ERROR 120.359 \
  CONFIG.CLKOUT2_REQUESTED_OUT_FREQ 177.778 \
  CONFIG.CLKOUT2_USED true \
  CONFIG.CLKOUT3_DRIVES BUFG \
  CONFIG.CLKOUT3_JITTER 118.639 \
  CONFIG.CLKOUT3_MATCHED_ROUTING true \
  CONFIG.CLKOUT3_PHASE_ERROR 120.359 \
  CONFIG.CLKOUT3_REQUESTED_OUT_FREQ 50 \
  CONFIG.CLKOUT3_USED true \
  CONFIG.CLKOUT4_DRIVES BUFG \
  CONFIG.CLKOUT4_JITTER 131.885 \
  CONFIG.CLKOUT4_PHASE_ERROR 120.359 \
  CONFIG.CLKOUT4_REQUESTED_OUT_FREQ 25 \
  CONFIG.CLKOUT4_USED true \
  CONFIG.CLKOUT5_DRIVES BUFG \
  CONFIG.CLKOUT5_JITTER 106.952 \
  CONFIG.CLKOUT5_PHASE_ERROR 120.359 \
  CONFIG.CLKOUT5_REQUESTED_OUT_FREQ 100 \
  CONFIG.CLKOUT5_USED false \
  CONFIG.CLKOUT6_DRIVES BUFG \
  CONFIG.CLKOUT6_JITTER 106.952 \
  CONFIG.CLKOUT6_PHASE_ERROR 120.359 \
  CONFIG.CLKOUT6_REQUESTED_OUT_FREQ 100 \
  CONFIG.CLKOUT6_USED false \
  CONFIG.CLKOUT7_DRIVES BUFG \
  CONFIG.CLK_OUT1_PORT clk_200mhz000 \
  CONFIG.CLK_OUT1_USE_FINE_PS_GUI false \
  CONFIG.CLK_OUT2_PORT clk_177mhz778 \
  CONFIG.CLK_OUT3_PORT clk_050mhz000 \
  CONFIG.CLK_OUT4_PORT clk_025mhz000 \
  CONFIG.CLK_OUT5_PORT clk_out5 \
  CONFIG.CLK_OUT6_PORT clk_out6 \
  CONFIG.FEEDBACK_SOURCE FDBK_AUTO \
  CONFIG.MMCM_BANDWIDTH OPTIMIZED \
  CONFIG.MMCM_CLKFBOUT_MULT_F 32 \
  CONFIG.MMCM_CLKIN1_PERIOD 20.000 \
  CONFIG.MMCM_CLKIN2_PERIOD 20.000 \
  CONFIG.MMCM_CLKOUT0_DIVIDE_F 8 \
  CONFIG.MMCM_CLKOUT0_USE_FINE_PS false \
  CONFIG.MMCM_CLKOUT1_DIVIDE 9 \
  CONFIG.MMCM_CLKOUT2_DIVIDE 32 \
  CONFIG.MMCM_CLKOUT3_DIVIDE 64 \
  CONFIG.MMCM_CLKOUT4_DIVIDE 1 \
  CONFIG.MMCM_CLKOUT5_DIVIDE 1 \
  CONFIG.MMCM_COMPENSATION ZHOLD \
  CONFIG.MMCM_DIVCLK_DIVIDE 1 \
  CONFIG.NUM_OUT_CLKS 4 \
  CONFIG.PHASE_DUTY_CONFIG false \
  CONFIG.PRIMITIVE PLL \
  CONFIG.PRIM_IN_FREQ 50 \
  CONFIG.PRIM_SOURCE No_buffer \
  CONFIG.SECONDARY_IN_FREQ 50 \
  CONFIG.SECONDARY_SOURCE No_buffer \
  CONFIG.USE_DYN_PHASE_SHIFT false \
  CONFIG.USE_DYN_RECONFIG false \
  CONFIG.USE_INCLK_SWITCHOVER true \
  CONFIG.USE_LOCKED false \
  CONFIG.USE_RESET true \
] [get_bd_cells clk_pll_trx_in_PLL_0]
create_bd_cell -type ip -vlnv xilinx.com:ip:clk_wiz:6.0 clk_pll_trx_in_MMCM_0
set_property -dict [list \
  CONFIG.CLKIN1_JITTER_PS 200.0 \
  CONFIG.CLKIN2_JITTER_PS 200.0 \
  CONFIG.CLKOUT1_DRIVES BUFG \
  CONFIG.CLKOUT1_JITTER 273.316 \
  CONFIG.CLKOUT1_PHASE_ERROR 162.874 \
  CONFIG.CLKOUT1_REQUESTED_OUT_FREQ 12 \
  CONFIG.CLKOUT2_DRIVES BUFG \
  CONFIG.CLKOUT2_JITTER 114.306 \
  CONFIG.CLKOUT2_PHASE_ERROR 120.359 \
  CONFIG.CLKOUT2_REQUESTED_OUT_FREQ 64 \
  CONFIG.CLKOUT2_USED false \
  CONFIG.CLKOUT3_DRIVES BUFG \
  CONFIG.CLKOUT3_JITTER 141.322 \
  CONFIG.CLKOUT3_PHASE_ERROR 120.359 \
  CONFIG.CLKOUT3_REQUESTED_OUT_FREQ 16 \
  CONFIG.CLKOUT3_USED false \
  CONFIG.CLKOUT4_DRIVES BUFG \
  CONFIG.CLKOUT4_JITTER 118.639 \
  CONFIG.CLKOUT4_PHASE_ERROR 120.359 \
  CONFIG.CLKOUT4_REQUESTED_OUT_FREQ 50 \
  CONFIG.CLKOUT4_USED false \
  CONFIG.CLKOUT5_DRIVES BUFG \
  CONFIG.CLKOUT5_JITTER 131.885 \
  CONFIG.CLKOUT5_PHASE_ERROR 120.359 \
  CONFIG.CLKOUT5_REQUESTED_OUT_FREQ 25 \
  CONFIG.CLKOUT5_USED false \
  CONFIG.CLKOUT6_DRIVES BUFG \
  CONFIG.CLKOUT6_JITTER 190.216 \
  CONFIG.CLKOUT6_PHASE_ERROR 138.123 \
  CONFIG.CLKOUT6_REQUESTED_OUT_FREQ 100.000 \
  CONFIG.CLKOUT6_USED false \
  CONFIG.CLKOUT7_DRIVES BUFG \
  CONFIG.CLK_OUT1_PORT clk_012mhz000 \
  CONFIG.CLK_OUT2_PORT clk_064mhz000 \
  CONFIG.CLK_OUT3_PORT clk_016mhz000 \
  CONFIG.CLK_OUT4_PORT clk_050mhz000 \
  CONFIG.CLK_OUT5_PORT clk_025mhz000 \
  CONFIG.CLK_OUT6_PORT clk_out6 \
  CONFIG.FEEDBACK_SOURCE FDBK_AUTO \
  CONFIG.MMCM_BANDWIDTH OPTIMIZED \
  CONFIG.MMCM_CLKFBOUT_MULT_F 20.250 \
  CONFIG.MMCM_CLKIN1_PERIOD 20.000 \
  CONFIG.MMCM_CLKIN2_PERIOD 20.000 \
  CONFIG.MMCM_CLKOUT0_DIVIDE_F 84.375 \
  CONFIG.MMCM_CLKOUT1_DIVIDE 1 \
  CONFIG.MMCM_CLKOUT2_DIVIDE 1 \
  CONFIG.MMCM_CLKOUT3_DIVIDE 1 \
  CONFIG.MMCM_CLKOUT4_DIVIDE 1 \
  CONFIG.MMCM_CLKOUT5_DIVIDE 1 \
  CONFIG.MMCM_COMPENSATION ZHOLD \
  CONFIG.MMCM_DIVCLK_DIVIDE 1 \
  CONFIG.NUM_OUT_CLKS 1 \
  CONFIG.PRIMITIVE MMCM \
  CONFIG.PRIM_IN_FREQ 50 \
  CONFIG.PRIM_SOURCE No_buffer \
  CONFIG.SECONDARY_IN_FREQ 50 \
  CONFIG.SECONDARY_SOURCE No_buffer \
  CONFIG.USE_INCLK_SWITCHOVER true \
  CONFIG.USE_LOCKED false \
  CONFIG.USE_RESET true \
] [get_bd_cells clk_pll_trx_in_MMCM_0]
create_bd_cell -type ip -vlnv xilinx.com:ip:proc_sys_reset:5.0 LVDS_016mhz000_SYSRESET_0
create_bd_cell -type ip -vlnv xilinx.com:ip:proc_sys_reset:5.0 LVDS_064mhz000_SYSRESET_0
create_bd_cell -type ip -vlnv xilinx.com:ip:cordic:6.0 LVDS_in_CORDIC_0
set_property -dict [list \
  CONFIG.Compensation_Scaling Embedded_Multiplier \
  CONFIG.Data_Format SignedFraction \
  CONFIG.Functional_Selection Translate \
  CONFIG.Input_Width 24 \
  CONFIG.Output_Width 16 \
  CONFIG.Round_Mode Nearest_Even \
  CONFIG.cartesian_has_tlast true \
  CONFIG.cartesian_has_tuser true \
  CONFIG.cartesian_tuser_width 44 \
  CONFIG.out_tlast_behv Pass_Cartesian_TLAST \
] [get_bd_cells LVDS_in_CORDIC_0]
create_bd_cell -type ip -vlnv xilinx.com:ip:xlconstant:1.1 const_width8_val0
set_property -dict {CONFIG.CONST_VAL 0 CONFIG.CONST_WIDTH 8} [get_bd_cells const_width8_val0]
create_bd_cell -type ip -vlnv xilinx.com:ip:c_counter_binary:12.0 LVDS_in_out_clk_BINCOUNTER_0
set_property -dict {CONFIG.Implementation DSP48 CONFIG.Output_Width 48} [get_bd_cells LVDS_in_out_clk_BINCOUNTER_0]
create_bd_cell -type ip -vlnv xilinx.com:ip:xlslice:1.0 LVDS_in_out_samplecounter_SLICE_0
set_property -dict [list \
  CONFIG.DIN_FROM 47 \
  CONFIG.DIN_TO 4 \
  CONFIG.DIN_WIDTH 48 \
  CONFIG.DOUT_WIDTH 1 \
] [get_bd_cells LVDS_in_out_samplecounter_SLICE_0]
create_bd_cell -type ip -vlnv xilinx.com:ip:xlslice:1.0 LVDS_in_out_sample_tvalid_SLICE_0
set_property -dict [list \
  CONFIG.DIN_FROM 3 \
  CONFIG.DIN_TO 0 \
  CONFIG.DIN_WIDTH 48 \
  CONFIG.DOUT_WIDTH 4 \
] [get_bd_cells LVDS_in_out_sample_tvalid_SLICE_0]
create_bd_cell -type ip -vlnv xilinx.com:ip:util_reduced_logic:2.0 LVDS_in_out_sample_tvalid_REDLOG_0
set_property -dict {CONFIG.C_OPERATION or CONFIG.C_SIZE 4} [get_bd_cells LVDS_in_out_sample_tvalid_REDLOG_0]
create_bd_cell -type ip -vlnv xilinx.com:ip:xlslice:1.0 LVDS_in_tlast_gen_SLICE_0
set_property -dict [list \
  CONFIG.DIN_FROM 10 \
  CONFIG.DIN_TO 0 \
  CONFIG.DIN_WIDTH 48 \
  CONFIG.DOUT_WIDTH 11 \
] [get_bd_cells LVDS_in_tlast_gen_SLICE_0]
create_bd_cell -type ip -vlnv xilinx.com:ip:util_reduced_logic:2.0 LVDS_in_tlast_gen_REDLOG_0
set_property -dict {CONFIG.C_SIZE 11} [get_bd_cells LVDS_in_tlast_gen_REDLOG_0]
create_bd_cell -type ip -vlnv xilinx.com:ip:c_shift_ram:12.0 LVDS_in_ShiftRAM_0
set_property -dict [list \
  CONFIG.AsyncInitRadix 16 \
  CONFIG.AsyncInitVal 00000000000 \
  CONFIG.DefaultData 00000000000 \
  CONFIG.DefaultDataRadix 16 \
  CONFIG.Depth 351 \
  CONFIG.SCLR true \
  CONFIG.Width 44 \
] [get_bd_cells LVDS_in_ShiftRAM_0]
create_bd_cell -type ip -vlnv xilinx.com:ip:util_reduced_logic:2.0 LVDS_in_tlast_gen_REDLOG_1
set_property -dict {CONFIG.C_SIZE 11} [get_bd_cells LVDS_in_tlast_gen_REDLOG_1]
create_bd_cell -type ip -vlnv xilinx.com:ip:util_vector_logic:2.0 LVDS_in_tlast_gen_VecLOG_1
set_property -dict {CONFIG.C_OPERATION xor CONFIG.C_SIZE 11} [get_bd_cells LVDS_in_tlast_gen_VecLOG_1]
create_bd_cell -type ip -vlnv xilinx.com:ip:xlconstant:1.1 const_width11_0x400
set_property -dict {CONFIG.CONST_VAL 1024 CONFIG.CONST_WIDTH 11} [get_bd_cells const_width11_0x400]
create_bd_cell -type ip -vlnv xilinx.com:ip:xlslice:1.0 LVDS_in_byte_SLICE_0
set_property -dict {CONFIG.DIN_FROM 0 CONFIG.DIN_TO 0 CONFIG.DIN_WIDTH 8 CONFIG.DOUT_WIDTH 1} [get_bd_cells LVDS_in_byte_SLICE_0]
create_bd_cell -type ip -vlnv xilinx.com:ip:xlconcat:2.1 LVDS_in_byte_CONCAT_0
set_property -dict [list \
  CONFIG.IN0_WIDTH 1 \
  CONFIG.IN1_WIDTH 1 \
  CONFIG.IN2_WIDTH 1 \
  CONFIG.IN3_WIDTH 1 \
  CONFIG.IN4_WIDTH 1 \
  CONFIG.IN5_WIDTH 1 \
  CONFIG.IN6_WIDTH 1 \
  CONFIG.IN7_WIDTH 1 \
  CONFIG.NUM_PORTS 8 \
] [get_bd_cells LVDS_in_byte_CONCAT_0]
create_bd_cell -type ip -vlnv xilinx.com:ip:xlslice:1.0 LVDS_in_byte_SLICE_1
set_property -dict {CONFIG.DIN_FROM 1 CONFIG.DIN_TO 1 CONFIG.DIN_WIDTH 8 CONFIG.DOUT_WIDTH 1} [get_bd_cells LVDS_in_byte_SLICE_1]
create_bd_cell -type ip -vlnv xilinx.com:ip:xlslice:1.0 LVDS_in_byte_SLICE_2
set_property -dict {CONFIG.DIN_FROM 2 CONFIG.DIN_TO 2 CONFIG.DIN_WIDTH 8 CONFIG.DOUT_WIDTH 1} [get_bd_cells LVDS_in_byte_SLICE_2]
create_bd_cell -type ip -vlnv xilinx.com:ip:xlslice:1.0 LVDS_in_byte_SLICE_3
set_property -dict {CONFIG.DIN_FROM 3 CONFIG.DIN_TO 3 CONFIG.DIN_WIDTH 8 CONFIG.DOUT_WIDTH 1} [get_bd_cells LVDS_in_byte_SLICE_3]
create_bd_cell -type ip -vlnv xilinx.com:ip:xlslice:1.0 LVDS_in_byte_SLICE_4
set_property -dict {CONFIG.DIN_FROM 4 CONFIG.DIN_TO 4 CONFIG.DIN_WIDTH 8 CONFIG.DOUT_WIDTH 1} [get_bd_cells LVDS_in_byte_SLICE_4]
create_bd_cell -type ip -vlnv xilinx.com:ip:xlslice:1.0 LVDS_in_byte_SLICE_5
set_property -dict {CONFIG.DIN_FROM 5 CONFIG.DIN_TO 5 CONFIG.DIN_WIDTH 8 CONFIG.DOUT_WIDTH 1} [get_bd_cells LVDS_in_byte_SLICE_5]
create_bd_cell -type ip -vlnv xilinx.com:ip:xlslice:1.0 LVDS_in_byte_SLICE_6
set_property -dict {CONFIG.DIN_FROM 6 CONFIG.DIN_TO 6 CONFIG.DIN_WIDTH 8 CONFIG.DOUT_WIDTH 1} [get_bd_cells LVDS_in_byte_SLICE_6]
create_bd_cell -type ip -vlnv xilinx.com:ip:xlslice:1.0 LVDS_in_byte_SLICE_7
set_property -dict {CONFIG.DIN_FROM 7 CONFIG.DIN_TO 7 CONFIG.DIN_WIDTH 8 CONFIG.DOUT_WIDTH 1} [get_bd_cells LVDS_in_byte_SLICE_7]
create_bd_cell -type ip -vlnv xilinx.com:ip:util_reduced_logic:2.0 LVDS_in_out_sample_tvalid_REDLOG_1
set_property -dict {CONFIG.C_OPERATION xor CONFIG.C_SIZE 2} [get_bd_cells LVDS_in_out_sample_tvalid_REDLOG_1]
create_bd_cell -type ip -vlnv xilinx.com:ip:xlconcat:2.1 LVDS_in_out_sample_tvalid_INV_0
create_bd_cell -type ip -vlnv xilinx.com:ip:c_counter_binary:12.0 LVDS_in_bitslip_COUNTER_0
set_property -dict [list \
  CONFIG.Output_Width 3 \
  CONFIG.SCLR true \
  CONFIG.Sync_Threshold_Output true \
  CONFIG.Threshold_Value 6 \
] [get_bd_cells LVDS_in_bitslip_COUNTER_0]
create_bd_cell -type ip -vlnv xilinx.com:ip:util_reduced_logic:2.0 LVDS_in_0cmp_INV_0
set_property -dict {CONFIG.C_OPERATION xor CONFIG.C_SIZE 2} [get_bd_cells LVDS_in_0cmp_INV_0]
create_bd_cell -type ip -vlnv xilinx.com:ip:xlconcat:2.1 LVDS_in_0cmp_CONCAT_0
create_bd_cell -type ip -vlnv xilinx.com:ip:util_reduced_logic:2.0 LVDS_in_byte_sync_REDLOG_0
set_property -dict {CONFIG.C_OPERATION xor CONFIG.C_SIZE 2} [get_bd_cells LVDS_in_byte_sync_REDLOG_0]
create_bd_cell -type ip -vlnv xilinx.com:ip:xlconcat:2.1 LVDS_in_byte_CONCAT_1
set_property -dict [list \
  CONFIG.IN0_WIDTH 1 \
  CONFIG.IN1_WIDTH 1 \
  CONFIG.IN2_WIDTH 1 \
  CONFIG.IN3_WIDTH 1 \
  CONFIG.IN4_WIDTH 1 \
  CONFIG.IN5_WIDTH 1 \
  CONFIG.IN6_WIDTH 1 \
  CONFIG.IN7_WIDTH 1 \
  CONFIG.NUM_PORTS 2 \
] [get_bd_cells LVDS_in_byte_CONCAT_1]
create_bd_cell -type ip -vlnv xilinx.com:ip:c_shift_ram:12.0 LVDS_in_byte_sync_SR_0
set_property -dict [list \
  CONFIG.AsyncInitVal 0 \
  CONFIG.DefaultData 0 \
  CONFIG.Depth 1 \
  CONFIG.Width 1 \
] [get_bd_cells LVDS_in_byte_sync_SR_0]
create_bd_cell -type ip -vlnv xilinx.com:ip:util_reduced_logic:2.0 LVDS_in_byte_sync_REDLOG_1
set_property -dict {CONFIG.C_OPERATION or CONFIG.C_SIZE 2} [get_bd_cells LVDS_in_byte_sync_REDLOG_1]
create_bd_cell -type ip -vlnv xilinx.com:ip:xlconcat:2.1 LVDS_in_byte_sync_CONCAT_0
set_property -dict [list \
  CONFIG.IN0_WIDTH 1 \
  CONFIG.IN1_WIDTH 1 \
  CONFIG.IN2_WIDTH 1 \
  CONFIG.IN3_WIDTH 1 \
  CONFIG.IN4_WIDTH 1 \
  CONFIG.IN5_WIDTH 1 \
  CONFIG.IN6_WIDTH 1 \
  CONFIG.IN7_WIDTH 1 \
  CONFIG.NUM_PORTS 2 \
] [get_bd_cells LVDS_in_byte_sync_CONCAT_0]
create_bd_cell -type ip -vlnv xilinx.com:ip:c_counter_binary:12.0 LVDS_in_byteswap_COUNTER_0
set_property -dict [list \
  CONFIG.CE false \
  CONFIG.Output_Width 2 \
  CONFIG.SCLR true \
  CONFIG.Sync_Threshold_Output true \
  CONFIG.Threshold_Value 2 \
] [get_bd_cells LVDS_in_byteswap_COUNTER_0]
create_bd_cell -type ip -vlnv xilinx.com:ip:c_shift_ram:12.0 LVDS_in_byte_sync_SR_1
set_property -dict [list \
  CONFIG.AsyncInitVal 0 \
  CONFIG.DefaultData 0 \
  CONFIG.Depth 1 \
  CONFIG.Width 1 \
] [get_bd_cells LVDS_in_byte_sync_SR_1]

# ---- hierarchy /mb_0_local_memory ----
current_bd_instance /mb_0_local_memory
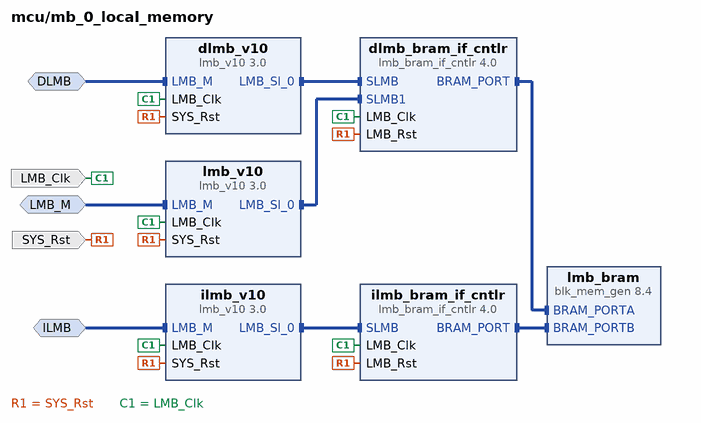
[diagram p7: block diagram inside /mb_0_local_memory]
create_bd_intf_pin -mode MirroredMaster -vlnv xilinx.com:interface:lmb_rtl:1.0 DLMB
create_bd_intf_pin -mode MirroredMaster -vlnv xilinx.com:interface:lmb_rtl:1.0 ILMB
create_bd_intf_pin -mode MirroredMaster -vlnv xilinx.com:interface:lmb_rtl:1.0 LMB_M
create_bd_pin -dir I -type clk LMB_Clk
create_bd_pin -dir I -type rst SYS_Rst

create_bd_cell -type ip -vlnv xilinx.com:ip:lmb_bram_if_cntlr:4.0 dlmb_bram_if_cntlr
set_property -dict {CONFIG.C_ECC 0 CONFIG.C_NUM_LMB 2} [get_bd_cells dlmb_bram_if_cntlr]
create_bd_cell -type ip -vlnv xilinx.com:ip:lmb_v10:3.0 dlmb_v10
create_bd_cell -type ip -vlnv xilinx.com:ip:lmb_bram_if_cntlr:4.0 ilmb_bram_if_cntlr
set_property -dict {CONFIG.C_ECC 0} [get_bd_cells ilmb_bram_if_cntlr]
create_bd_cell -type ip -vlnv xilinx.com:ip:lmb_v10:3.0 ilmb_v10
create_bd_cell -type ip -vlnv xilinx.com:ip:blk_mem_gen:8.4 lmb_bram
set_property -dict [list \
  CONFIG.Enable_B Use_ENB_Pin \
  CONFIG.Memory_Type True_Dual_Port_RAM \
  CONFIG.Port_A_Write_Rate 50 \
  CONFIG.Port_B_Clock 100 \
  CONFIG.Port_B_Enable_Rate 100 \
  CONFIG.Port_B_Write_Rate 50 \
  CONFIG.Use_RSTB_Pin true \
  CONFIG.use_bram_block BRAM_Controller \
] [get_bd_cells lmb_bram]
create_bd_cell -type ip -vlnv xilinx.com:ip:lmb_v10:3.0 lmb_v10

# ---- connections ----

current_bd_instance /mb_0_local_memory
connect_bd_intf_net -intf_net microblaze_0_dlmb_bus [get_bd_intf_pins dlmb_bram_if_cntlr/SLMB] [get_bd_intf_pins dlmb_v10/LMB_Sl_0]
connect_bd_intf_net -intf_net microblaze_0_dlmb_cntlr [get_bd_intf_pins dlmb_bram_if_cntlr/BRAM_PORT] [get_bd_intf_pins lmb_bram/BRAM_PORTA]
connect_bd_intf_net -intf_net microblaze_0_ilmb [get_bd_intf_pins ILMB] [get_bd_intf_pins ilmb_v10/LMB_M]
connect_bd_intf_net -intf_net microblaze_0_ilmb_bus [get_bd_intf_pins ilmb_bram_if_cntlr/SLMB] [get_bd_intf_pins ilmb_v10/LMB_Sl_0]
connect_bd_intf_net -intf_net microblaze_0_lmb_bus [get_bd_intf_pins dlmb_bram_if_cntlr/SLMB1] [get_bd_intf_pins lmb_v10/LMB_Sl_0]
connect_bd_intf_net -intf_net microblaze_0_lmb [get_bd_intf_pins LMB_M] [get_bd_intf_pins lmb_v10/LMB_M]
connect_bd_intf_net -intf_net microblaze_0_dlmb [get_bd_intf_pins DLMB] [get_bd_intf_pins dlmb_v10/LMB_M]
connect_bd_intf_net -intf_net microblaze_0_ilmb_cntlr [get_bd_intf_pins ilmb_bram_if_cntlr/BRAM_PORT] [get_bd_intf_pins lmb_bram/BRAM_PORTB]
connect_bd_net [get_bd_pins SYS_Rst] \
  [get_bd_pins dlmb_bram_if_cntlr/LMB_Rst] [get_bd_pins dlmb_v10/SYS_Rst] [get_bd_pins ilmb_bram_if_cntlr/LMB_Rst] \
  [get_bd_pins ilmb_v10/SYS_Rst] [get_bd_pins lmb_v10/SYS_Rst]
connect_bd_net -net microblaze_0_Clk [get_bd_pins LMB_Clk] \
  [get_bd_pins dlmb_bram_if_cntlr/LMB_Clk] [get_bd_pins dlmb_v10/LMB_Clk] [get_bd_pins ilmb_bram_if_cntlr/LMB_Clk] \
  [get_bd_pins ilmb_v10/LMB_Clk] [get_bd_pins lmb_v10/LMB_Clk]
set_property HDL_ATTRIBUTE.BMM_INFO_ADDRESS_SPACE {byte  0x00000000 32 > mcu mb_0_local_memory/lmb_bram} [get_bd_cells dlmb_bram_if_cntlr]
set_property HDL_ATTRIBUTE.KEEP_HIERARCHY yes [get_bd_cells dlmb_bram_if_cntlr]

current_bd_instance /
connect_bd_intf_net -intf_net axi_quad_spi_0_spi [get_bd_intf_ports spi_rtl_0_config] [get_bd_intf_pins axi_quad_spi_0_CONFIG/SPI_0]
connect_bd_intf_net [get_bd_intf_pins mb_0/INTERRUPT] [get_bd_intf_pins mb_0_axi_intc/interrupt]
connect_bd_intf_net [get_bd_intf_pins mb_0_axi_interconnect_bot2/M02_AXI] [get_bd_intf_pins axi_timer_0/S_AXI]
connect_bd_intf_net [get_bd_intf_pins mb_0_axi_interconnect_top/M02_AXI] [get_bd_intf_pins mig_7series_0/S_AXI]
connect_bd_intf_net -intf_net axi_iic_0_iic [get_bd_intf_ports iic_rtl_0_pll] [get_bd_intf_pins axi_iic_0_PLL/IIC]
connect_bd_intf_net -intf_net axi_quad_spi_1_spi [get_bd_intf_ports spi_rtl_1_trx] [get_bd_intf_pins axi_quad_spi_1_TRX/SPI_0]
connect_bd_intf_net -intf_net axi_ethernetlite_0_MII [get_bd_intf_pins axi_ethernetlite_ETHERNET/MII] [get_bd_intf_pins mii_to_rmii_ETHERNET/MII]
connect_bd_intf_net [get_bd_intf_pins mb_0_axi_interconnect_bot2/M05_AXI] [get_bd_intf_pins axi_quad_spi_1_TRX/AXI_LITE]
connect_bd_intf_net [get_bd_intf_pins axi_gpio_7_LVDS/S_AXI] [get_bd_intf_pins mb_0_axi_interconnect_bot1/M05_AXI]
connect_bd_intf_net [get_bd_intf_ports gpio_rtl_1_onewire_gpio_out] [get_bd_intf_pins axi_gpio_1_ONEWIRE_out/GPIO2]
connect_bd_intf_net [get_bd_intf_pins mb_0_axi_interconnect_bot2/M00_AXI] [get_bd_intf_pins mb_0_axi_intc/s_axi]
connect_bd_intf_net -intf_net axi_uart16550_0_uart [get_bd_intf_ports uart_rtl_0_ftdi] [get_bd_intf_pins axi_uart16550_FTDI_0/UART]
connect_bd_intf_net [get_bd_intf_pins axi_ethernetlite_ETHERNET/S_AXI] [get_bd_intf_pins mb_0_axi_interconnect_bot1/M00_AXI]
connect_bd_intf_net [get_bd_intf_ports mdio_rtl_0_ethernet] [get_bd_intf_pins axi_ethernetlite_ETHERNET/MDIO]
connect_bd_intf_net [get_bd_intf_pins axi_iic_1_BOARD/S_AXI] [get_bd_intf_pins mb_0_axi_interconnect_bot1/M07_AXI]
connect_bd_intf_net [get_bd_intf_pins mb_0_axi_interconnect_bot1/S00_AXI] [get_bd_intf_pins mb_0_axi_interconnect_top/M00_AXI]
connect_bd_intf_net [get_bd_intf_ports FSM_LVDS_in_CORDIC_0_M_AXIS] [get_bd_intf_pins LVDS_in_CORDIC_0/M_AXIS_DOUT]
connect_bd_intf_net [get_bd_intf_pins mb_0/M_AXI_DC] [get_bd_intf_pins mb_0_axi_interconnect_top/S02_AXI]
connect_bd_intf_net [get_bd_intf_ports gpio_rtl_1_onewire_gpio_in] [get_bd_intf_pins axi_gpio_2_ONEWIRE_in/GPIO2]
connect_bd_intf_net [get_bd_intf_pins mb_0_axi_interconnect_bot1/M03_AXI] [get_bd_intf_pins axi_gpio_2_ONEWIRE_in/S_AXI]
connect_bd_intf_net [get_bd_intf_pins mb_0/M_AXI_DP] [get_bd_intf_pins mb_0_axi_interconnect_top/S00_AXI]
connect_bd_intf_net [get_bd_intf_pins mb_0_axi_interconnect_bot1/M02_AXI] [get_bd_intf_pins axi_gpio_1_ONEWIRE_out/S_AXI]
connect_bd_intf_net [get_bd_intf_pins mb_0_axi_interconnect_bot1/M04_AXI] [get_bd_intf_pins axi_gpio_3_ROTENC/S_AXI]
connect_bd_intf_net [get_bd_intf_pins mb_0_axi_interconnect_bot2/M04_AXI] [get_bd_intf_pins axi_quad_spi_0_CONFIG/AXI_LITE]
connect_bd_intf_net [get_bd_intf_ports ddr3_sdram] [get_bd_intf_pins mig_7series_0/DDR3]
connect_bd_intf_net [get_bd_intf_pins axi_iic_0_PLL/S_AXI] [get_bd_intf_pins mb_0_axi_interconnect_bot1/M06_AXI]
connect_bd_intf_net -intf_net axi_iic_0_iic1 [get_bd_intf_ports iic_rtl_1_board] [get_bd_intf_pins axi_iic_1_BOARD/IIC]
connect_bd_intf_net -intf_net axi_gpio_0_gpio [get_bd_intf_ports gpio_rtl_0_multi] [get_bd_intf_pins axi_gpio_0_MULTI/GPIO]
connect_bd_intf_net [get_bd_intf_pins mb_0_axi_interconnect_bot1/M01_AXI] [get_bd_intf_pins axi_gpio_0_MULTI/S_AXI]
connect_bd_intf_net [get_bd_intf_pins mb_0_local_memory/LMB_M] [get_bd_intf_pins mb_0_mdm/LMB_0]
connect_bd_intf_net [get_bd_intf_pins mb_0_axi_interconnect_bot2/S00_AXI] [get_bd_intf_pins mb_0_axi_interconnect_top/M01_AXI]
connect_bd_intf_net [get_bd_intf_pins mb_0_axi_interconnect_bot2/M03_AXI] [get_bd_intf_pins axi_uart16550_FTDI_0/S_AXI]
connect_bd_intf_net [get_bd_intf_pins mb_0/ILMB] [get_bd_intf_pins mb_0_local_memory/ILMB]
connect_bd_intf_net -intf_net mb_0_mdm_MDEBUG_0 [get_bd_intf_pins mb_0/DEBUG] [get_bd_intf_pins mb_0_mdm/MBDEBUG_0]
connect_bd_intf_net [get_bd_intf_pins mb_0/M_AXI_IC] [get_bd_intf_pins mb_0_axi_interconnect_top/S03_AXI]
connect_bd_intf_net [get_bd_intf_ports rmii_rtl_0_ethernet] [get_bd_intf_pins mii_to_rmii_ETHERNET/RMII_PHY_M]
connect_bd_intf_net [get_bd_intf_pins mb_0/DLMB] [get_bd_intf_pins mb_0_local_memory/DLMB]
connect_bd_intf_net [get_bd_intf_pins mb_0_axi_interconnect_bot2/M01_AXI] [get_bd_intf_pins mb_0_mdm/S_AXI]
connect_bd_intf_net [get_bd_intf_pins mb_0_axi_interconnect_top/S01_AXI] [get_bd_intf_pins mb_0_mdm/M_AXI]
connect_bd_net [get_bd_pins axi_ethernetlite_ETHERNET/ip2intc_irpt] [get_bd_pins mb_0_axi_intc_concat/In11]
connect_bd_net [get_bd_pins axi_gpio_1_ONEWIRE_out/gpio_io_o] [get_bd_pins onewire_DMR_0/dpra]
connect_bd_net -net axi_gpio_2_onewire_ip2intc_irpt [get_bd_pins axi_gpio_2_ONEWIRE_in/ip2intc_irpt] [get_bd_pins mb_0_axi_intc_concat/In10]
connect_bd_net [get_bd_pins axi_gpio_3_ROTENC/ip2intc_irpt] [get_bd_pins mb_0_axi_intc_concat/In9]
connect_bd_net -net axi_gpio_3_rotenc_push [get_bd_ports board_rotenc_push] [get_bd_pins axi_gpio_3_ROTENC/gpio2_io_i]
connect_bd_net [get_bd_pins axi_iic_0_PLL/iic2intc_irpt] [get_bd_pins mb_0_axi_intc_concat/In4]
connect_bd_net [get_bd_pins axi_iic_1_BOARD/iic2intc_irpt] [get_bd_pins mb_0_axi_intc_concat/In7]
connect_bd_net [get_bd_pins axi_quad_spi_0_CONFIG/ip2intc_irpt] [get_bd_pins mb_0_axi_intc_concat/In3]
connect_bd_net [get_bd_pins axi_quad_spi_1_TRX/ip2intc_irpt] [get_bd_pins mb_0_axi_intc_concat/In5]
connect_bd_net -net axi_timer_0_irpt [get_bd_pins axi_timer_0/interrupt] [get_bd_pins mb_0_axi_intc_concat/In1]
connect_bd_net -net axi_timer_0_lcd_pwm0 [get_bd_pins axi_timer_0/pwm0] [get_bd_ports pwm0_lcd_bl_obuf]
connect_bd_net -net axi_uart16550_0_ftdi_ip2intc_irpt [get_bd_pins axi_uart16550_FTDI_0/ip2intc_irpt] [get_bd_pins mb_0_axi_intc_concat/In2]
connect_bd_net -net rotenc_ACCU_0_add [get_bd_ports board_rotenc_up] [get_bd_pins rotenc_ACCU_0/ADD]
connect_bd_net [get_bd_pins rotenc_ACCU_0/Q] [get_bd_pins axi_gpio_3_ROTENC/gpio_io_i]
connect_bd_net [get_bd_pins LVDS_in_byte_CONCAT_0/dout] [get_bd_pins LVDS_in_byte_CDC_0/d] [get_bd_pins LVDS_in_FIFO_combiner_0/din]
connect_bd_net [get_bd_pins LVDS_in_byte_CDC_0/qdpo] [get_bd_pins axi_gpio_7_LVDS/gpio2_io_i]
connect_bd_net -net LVDS_out_CDC_0_data [get_bd_pins axi_gpio_7_LVDS/gpio_io_o] [get_bd_pins LVDS_out_CDC_0/d]
connect_bd_net [get_bd_pins LVDS_out_CDC_0/qdpo] [get_bd_pins LVDS_out_SERDES_0/data_out_from_device]
connect_bd_net -net clk_025mhz000_n [get_bd_pins clk_pll_trx_in_PLL_0/clk_025mhz000] \
  [get_bd_pins axi_quad_spi_0_CONFIG/ext_spi_clk] [get_bd_pins axi_quad_spi_1_TRX/ext_spi_clk]
connect_bd_net [get_bd_pins onewire_DMR_0/qdpo] [get_bd_pins axi_gpio_2_ONEWIRE_in/gpio_io_i]
connect_bd_net -net onewire_DMR_0_a_in [get_bd_ports dmr_1_onewire_a_in] [get_bd_pins onewire_DMR_0/a]
connect_bd_net -net onewire_DMR_0_d_in [get_bd_ports dmr_1_onewire_d_in] [get_bd_pins onewire_DMR_0/d]
connect_bd_net -net mb_axi_clk_083mhz333 [get_bd_pins mig_7series_0/ui_clk] \
  [get_bd_ports mb_axi_clk_083mhz333] [get_bd_pins LVDS_in_byte_CDC_0/qdpo_clk] [get_bd_pins LVDS_out_CDC_0/clk] \
  [get_bd_pins axi_ethernetlite_ETHERNET/s_axi_aclk] [get_bd_pins axi_gpio_0_MULTI/s_axi_aclk] \
  [get_bd_pins axi_gpio_1_ONEWIRE_out/s_axi_aclk] [get_bd_pins axi_gpio_2_ONEWIRE_in/s_axi_aclk] \
  [get_bd_pins axi_gpio_3_ROTENC/s_axi_aclk] [get_bd_pins axi_gpio_7_LVDS/s_axi_aclk] [get_bd_pins axi_iic_0_PLL/s_axi_aclk] \
  [get_bd_pins axi_iic_1_BOARD/s_axi_aclk] [get_bd_pins axi_quad_spi_0_CONFIG/s_axi_aclk] \
  [get_bd_pins axi_quad_spi_1_TRX/s_axi_aclk] [get_bd_pins axi_timer_0/s_axi_aclk] \
  [get_bd_pins axi_uart16550_FTDI_0/s_axi_aclk] [get_bd_pins rotenc_ACCU_0/CLK] [get_bd_pins onewire_DMR_0/clk] \
  [get_bd_pins mb_0/Clk] [get_bd_pins mb_0_axi_intc/processor_clk] [get_bd_pins mb_0_axi_intc/s_axi_aclk] \
  [get_bd_pins mb_0_axi_interconnect_top/ACLK] [get_bd_pins mb_0_axi_interconnect_top/M00_ACLK] \
  [get_bd_pins mb_0_axi_interconnect_top/M01_ACLK] [get_bd_pins mb_0_axi_interconnect_top/S00_ACLK] \
  [get_bd_pins mb_0_axi_interconnect_top/S01_ACLK] [get_bd_pins mb_0_axi_interconnect_top/S02_ACLK] \
  [get_bd_pins mb_0_axi_interconnect_top/S03_ACLK] [get_bd_pins mb_0_local_memory/LMB_Clk] [get_bd_pins mb_0_mdm/M_AXI_ACLK] \
  [get_bd_pins mb_0_mdm/S_AXI_ACLK] [get_bd_pins mb_0_reset/slowest_sync_clk] [get_bd_pins mb_0_axi_interconnect_bot1/ACLK] \
  [get_bd_pins mb_0_axi_interconnect_bot2/ACLK] [get_bd_pins mb_0_axi_interconnect_bot2/S00_ACLK] \
  [get_bd_pins mb_0_axi_interconnect_bot1/S00_ACLK] [get_bd_pins mb_0_axi_interconnect_bot1/M01_ACLK] \
  [get_bd_pins mb_0_axi_interconnect_bot1/M02_ACLK] [get_bd_pins mb_0_axi_interconnect_bot1/M03_ACLK] \
  [get_bd_pins mb_0_axi_interconnect_bot1/M04_ACLK] [get_bd_pins mb_0_axi_interconnect_bot1/M05_ACLK] \
  [get_bd_pins mb_0_axi_interconnect_bot1/M06_ACLK] [get_bd_pins mb_0_axi_interconnect_bot1/M07_ACLK] \
  [get_bd_pins mb_0_axi_interconnect_bot2/M00_ACLK] [get_bd_pins mb_0_axi_interconnect_bot2/M01_ACLK] \
  [get_bd_pins mb_0_axi_interconnect_bot2/M02_ACLK] [get_bd_pins mb_0_axi_interconnect_bot2/M03_ACLK] \
  [get_bd_pins mb_0_axi_interconnect_bot2/M04_ACLK] [get_bd_pins mb_0_axi_interconnect_bot2/M05_ACLK] \
  [get_bd_pins mb_0_axi_interconnect_top/M02_ACLK] [get_bd_pins mb_0_axi_interconnect_bot1/M00_ACLK]
connect_bd_net -net mb_0_intr_in [get_bd_pins mb_0_axi_intc_concat/dout] [get_bd_pins mb_0_axi_intc/intr]
connect_bd_net [get_bd_pins mb_0_mdm/Interrupt] [get_bd_pins mb_0_axi_intc_concat/In0]
connect_bd_net [get_bd_pins mb_0_mdm/Debug_SYS_Rst] [get_bd_pins mb_0_reset/mb_debug_sys_rst]
connect_bd_net -net mb_0_reset_aux_reset_in [get_bd_ports reset] \
  [get_bd_pins mb_0_reset/aux_reset_in] [get_bd_pins LVDS_016mhz000_SYSRESET_0/aux_reset_in] \
  [get_bd_pins LVDS_064mhz000_SYSRESET_0/aux_reset_in] [get_bd_pins clk_pll_trx_in_MMCM_0/reset] \
  [get_bd_pins clk_pll_trx_in_PLL_0/reset]
connect_bd_net [get_bd_pins mb_0_reset/bus_struct_reset] [get_bd_pins mb_0_local_memory/SYS_Rst]
connect_bd_net [get_bd_pins mb_0_reset/interconnect_aresetn] \
  [get_bd_pins mb_0_axi_interconnect_top/ARESETN] [get_bd_pins mb_0_axi_interconnect_bot1/ARESETN] \
  [get_bd_pins mb_0_axi_interconnect_bot2/ARESETN]
connect_bd_net [get_bd_pins mb_0_reset/mb_reset] [get_bd_pins mb_0/Reset] [get_bd_pins mb_0_axi_intc/processor_rst]
